# Altium project Cubesat EPS.PrjPcb (part 1 of 4)
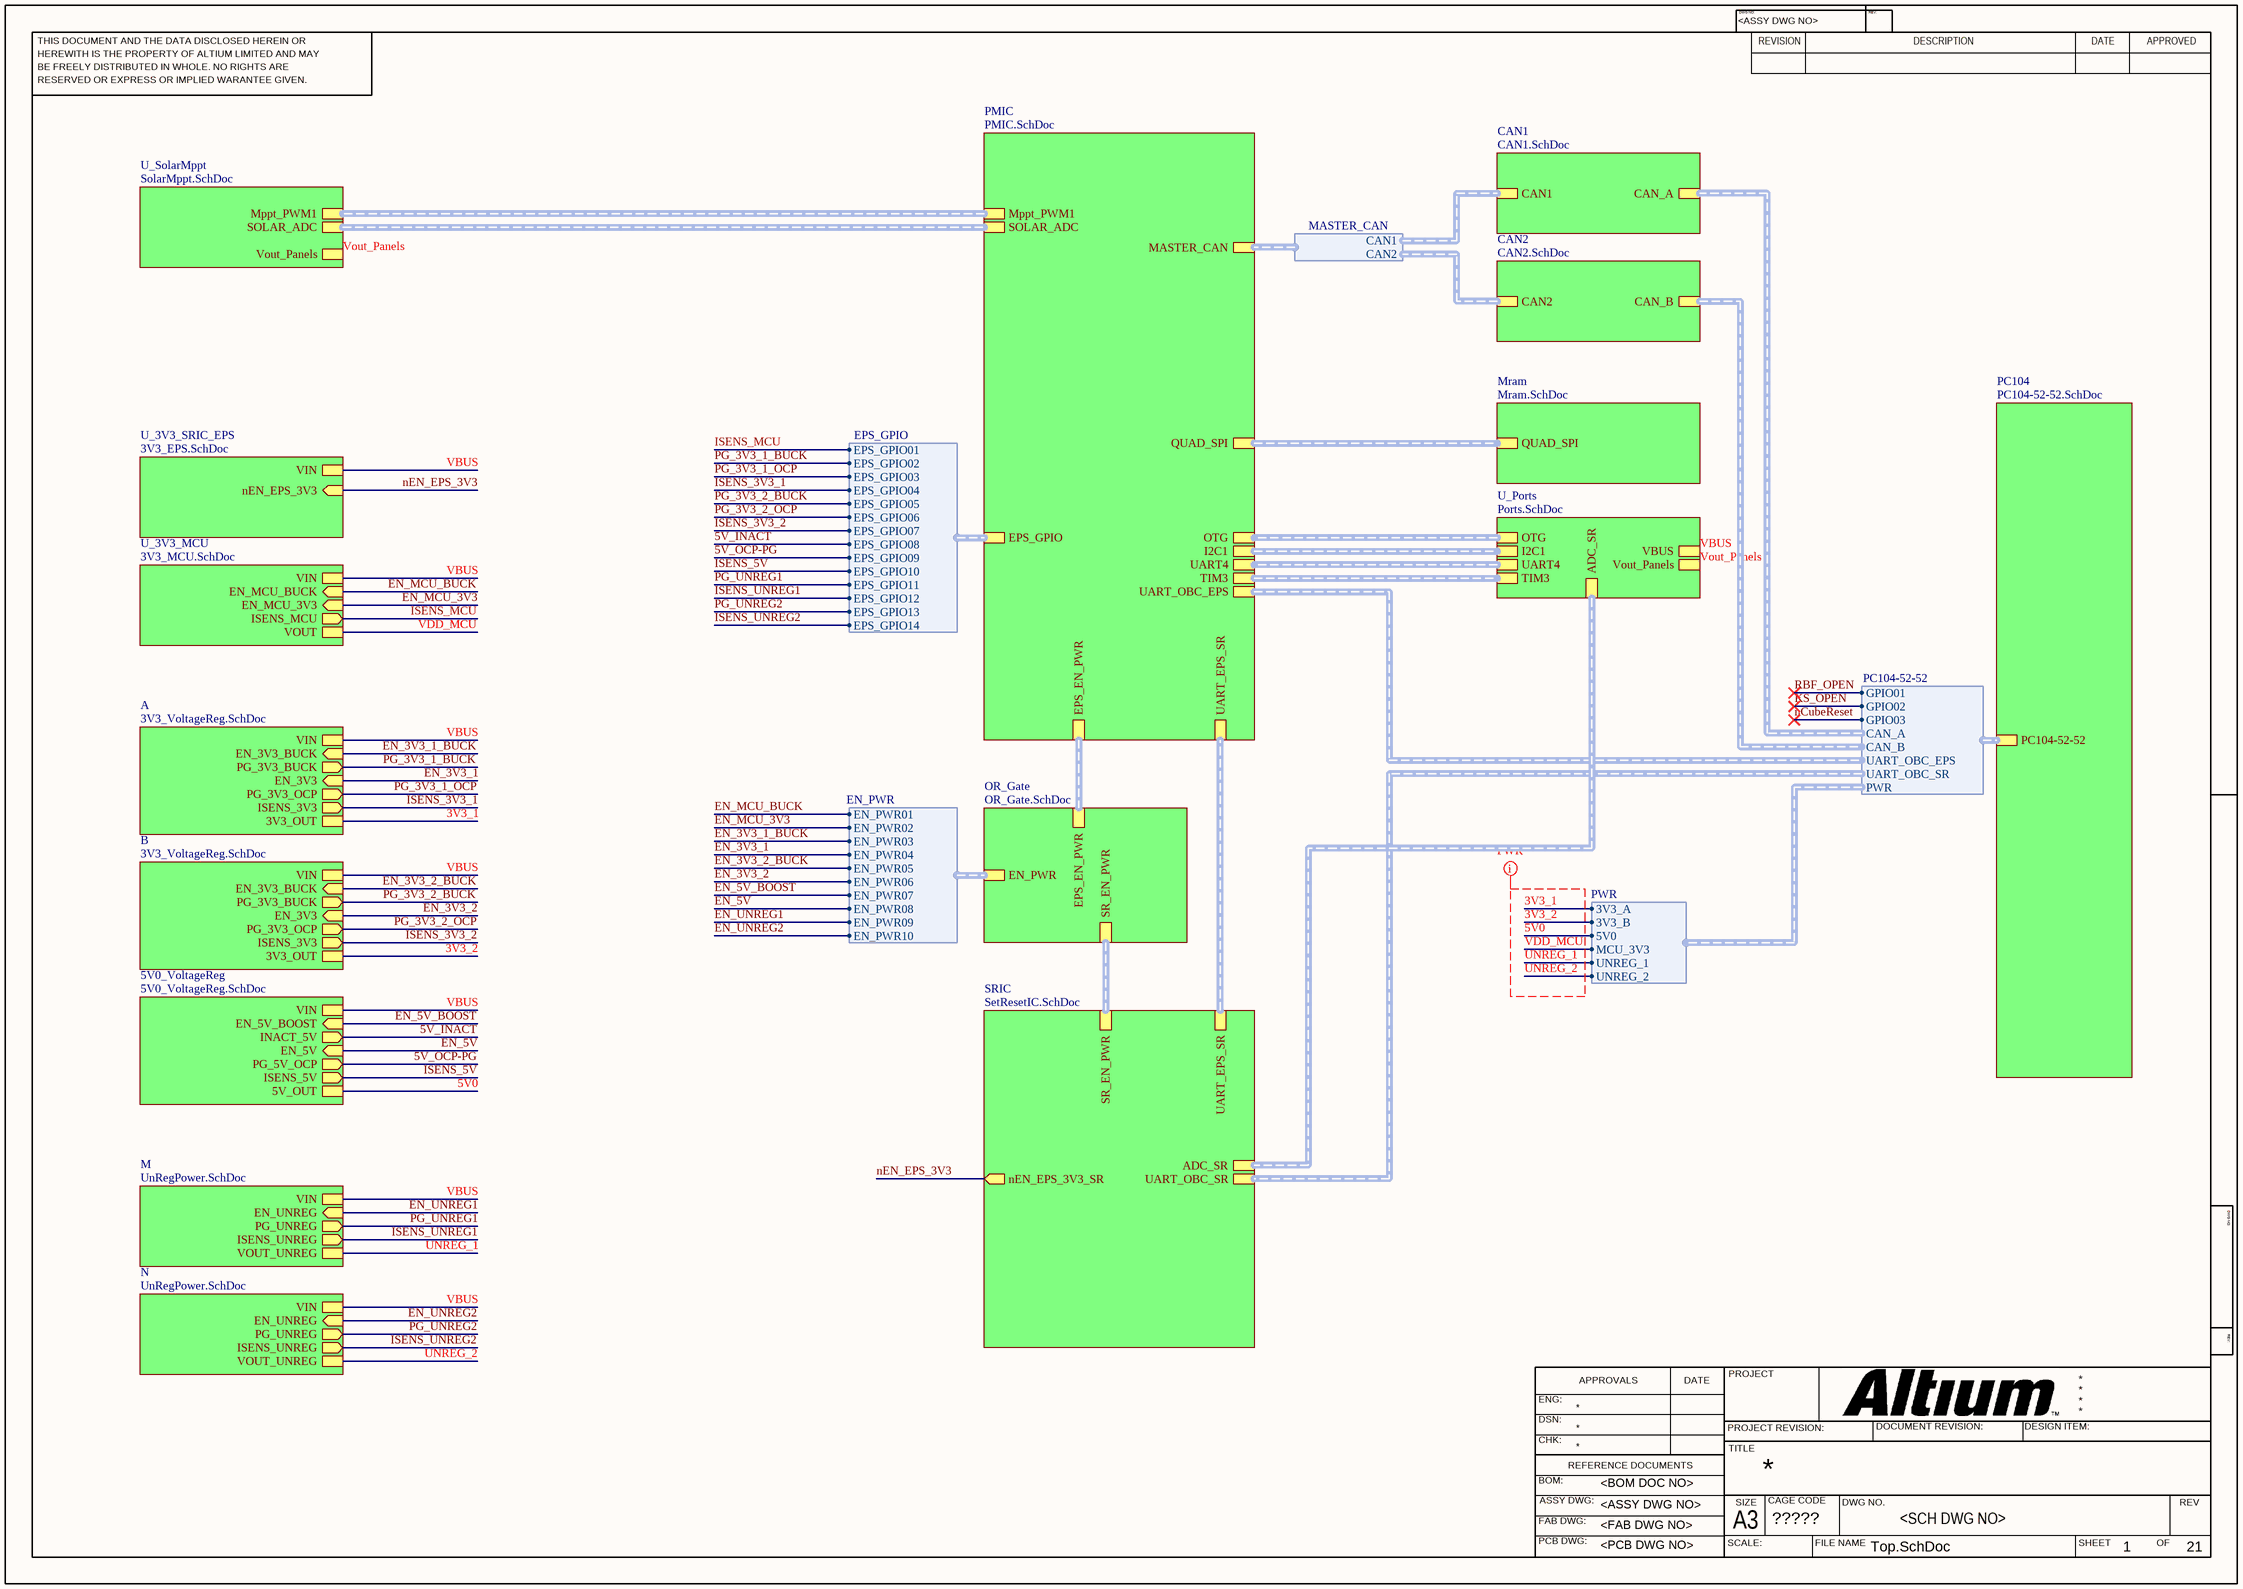
[diagram p0: Top.SchDoc]
CAGE_CODE: ?????; CONTRACT_NUMBER: <CONTRACT NO>; DOC_NO_ASSY_DWG: <ASSY DWG NO>; DOC_NO_BOM: <BOM DOC NO>; DOC_NO_FAB_DWG: <FAB DWG NO>; DOC_NO_SCH_DWG: <SCH DWG NO>; PCB_2_DEC_TOL: +/-.01; PCB_3_DEC_TOL: +/-.010; PCB_ANG_TOL: +/-1/2; PCB_ASSEMBLY_NO: <PCB ASSY NO>; PCB_CHECKER: - -----; PCB_CHECKER_APP_DATE: --/--/----; PCB_DESIGNER: - -----; PCB_DESIGNER_APP_DATE: --/--/----; PCB_DWG_NO: <PCB DWG NO>; PCB_ENGINEER: - -----; PCB_ENGINEER_APP_DATE: --/--/----; PCB_PART_NUMBER: <PCB PN>; PCB_REV: A; SCH_REV: A
21 sheets, 413 parts. Net scope: hierarchical (ports join the sheet entries above them; power ports are global).
Board file: EPS_v1.PcbDoc
Sheets:
  Top.SchDoc
    PMIC = PMIC.SchDoc
      PMIC_Watchdog = PMIC_Watchdog.SchDoc
      PMIC_Power = PMIC_Power.SchDoc
      PMIC_Crystal = PMIC_Crystal.SchDoc
      PMIC_Debug = PMIC_Debug.SchDoc
    PC104 = PC104-52-52.SchDoc
    Mram = Mram.SchDoc
    CAN1 = CAN1.SchDoc
    CAN2 = CAN2.SchDoc
    A = 3V3_VoltageReg.SchDoc
    5V0_VoltageReg = 5V0_VoltageReg.SchDoc
    U_3V3_MCU = 3V3_MCU.SchDoc
    U_3V3_SRIC_EPS = 3V3_EPS.SchDoc
    M = UnRegPower.SchDoc
    SRIC = SetResetIC.SchDoc
      U_SRIC_Peripherals = SRIC_Peripherals.SchDoc
    OR_Gate = OR_Gate.SchDoc
    U_Ports = Ports.SchDoc
    U_SolarMppt = SolarMppt.SchDoc
      XY = Panels.SchDoc
      ZX = Panels.SchDoc
      YZ = Panels.SchDoc
    B = 3V3_VoltageReg.SchDoc
    N = UnRegPower.SchDoc

## Sheet Top.SchDoc
size 420 x 297 mm; SheetNumber: 1; SheetTotal: 21

### Sub-sheets
5V0_VoltageReg = 5V0_VoltageReg.SchDoc: EN_5V (in), EN_5V_BOOST (in), PG_5V_OCP (out), INACT_5V (out), ISENS_5V (out), 5V_OUT, VIN
A = 3V3_VoltageReg.SchDoc: EN_3V3 (in), EN_3V3_BUCK (in), PG_3V3_BUCK (out), PG_3V3_OCP (out), ISENS_3V3 (out), 3V3_OUT, VIN
B = 3V3_VoltageReg.SchDoc: EN_3V3 (in), EN_3V3_BUCK (in), PG_3V3_BUCK (out), PG_3V3_OCP (out), ISENS_3V3 (out), 3V3_OUT, VIN
CAN1 = CAN1.SchDoc: CAN_A (harness CAN_A), CAN1 (harness CAN1)
CAN2 = CAN2.SchDoc: CAN_B (harness CAN_b), CAN2 (harness CAN2)
M = UnRegPower.SchDoc: EN_UNREG (in), PG_UNREG (out), ISENS_UNREG (out), VOUT_UNREG, VIN
Mram = Mram.SchDoc: QUAD_SPI (harness QUAD_SPI)
N = UnRegPower.SchDoc: EN_UNREG (in), PG_UNREG (out), ISENS_UNREG (out), VOUT_UNREG, VIN
OR_Gate = OR_Gate.SchDoc: EPS_EN_PWR (harness EPS_EN_PWR), SR_EN_PWR (harness SR_EN_PWR), EN_PWR (harness EN_PWR)
PC104 = PC104-52-52.SchDoc: PC104-52-52 (harness PC104-52-52)
PMIC = PMIC.SchDoc: MASTER_CAN (harness MASTER_CAN), QUAD_SPI (harness QUAD_SPI), EPS_EN_PWR (harness EPS_EN_PWR), EPS_GPIO (harness EPS_GPIO), UART4 (harness UART4), SOLAR_ADC (harness SOLAR_ADC), Mppt_PWM1 (harness Mppt_PWM), UART_EPS_SR (harness UART_EPS_SR), UART_OBC_EPS (harness UART_OBC_EPS), I2C1 (harness I2C1), OTG (harness OTG), TIM3 (harness TIM3)
SRIC = SetResetIC.SchDoc: UART_OBC_SR (harness UART_OBC_SR), SR_EN_PWR (harness SR_EN_PWR), UART_EPS_SR (harness UART_EPS_SR), nEN_EPS_3V3_SR (out), ADC_SR (harness ADC_SR)
U_3V3_MCU = 3V3_MCU.SchDoc: EN_MCU_3V3 (in), EN_MCU_BUCK (in), ISENS_MCU (out), VIN, VOUT
U_3V3_SRIC_EPS = 3V3_EPS.SchDoc: nEN_EPS_3V3 (in), VIN
U_Ports = Ports.SchDoc: UART4 (harness UART4), I2C1 (harness I2C1), OTG (harness OTG), TIM3 (harness TIM3), VBUS, Vout_Panels, ADC_SR (harness ADC_SR)
U_SolarMppt = SolarMppt.SchDoc: SOLAR_ADC (harness SOLAR_ADC), Mppt_PWM1 (harness Mppt_PWM), Vout_Panels

### Harnesses
MASTER_CAN: CAN1, CAN2
EN_PWR: EN_PWR01, EN_PWR02, EN_PWR03, EN_PWR04, EN_PWR05, EN_PWR06, EN_PWR07, EN_PWR08, EN_PWR09, EN_PWR10
EPS_GPIO: EPS_GPIO01, EPS_GPIO02, EPS_GPIO03, EPS_GPIO04, EPS_GPIO05, EPS_GPIO06, EPS_GPIO07, EPS_GPIO08, EPS_GPIO09, EPS_GPIO10, EPS_GPIO11, EPS_GPIO12, EPS_GPIO13, EPS_GPIO14
PWR: 3V3_A, 3V3_B, 5V0, MCU_3V3, UNREG_1, UNREG_2
PC104-52-52: GPIO01, GPIO02, GPIO03, CAN_A, CAN_B, PWR, UART_OBC_EPS, UART_OBC_SR

### Nets
3V3_1: sheet A/3V3_OUT, harness PWR.3V3_A
3V3_2: sheet B/3V3_OUT, harness PWR.3V3_B
5V0: sheet 5V0_VoltageReg/5V_OUT, harness PWR.5V0
5V_INACT: sheet 5V0_VoltageReg/INACT_5V, sheet PMIC/EPS_GPIO.EPS_GPIO08
5V_OCP-PG: sheet 5V0_VoltageReg/PG_5V_OCP, sheet PMIC/EPS_GPIO.EPS_GPIO09
EN_3V3_1: sheet A/EN_3V3, sheet OR_Gate/EN_PWR.EN_PWR04
EN_3V3_1_BUCK: sheet A/EN_3V3_BUCK, sheet OR_Gate/EN_PWR.EN_PWR03
EN_3V3_2: sheet B/EN_3V3, sheet OR_Gate/EN_PWR.EN_PWR06
EN_3V3_2_BUCK: sheet B/EN_3V3_BUCK, sheet OR_Gate/EN_PWR.EN_PWR05
EN_5V: sheet 5V0_VoltageReg/EN_5V, sheet OR_Gate/EN_PWR.EN_PWR08
EN_5V_BOOST: sheet 5V0_VoltageReg/EN_5V_BOOST, sheet OR_Gate/EN_PWR.EN_PWR07
EN_MCU_3V3: sheet U_3V3_MCU/EN_MCU_3V3, sheet OR_Gate/EN_PWR.EN_PWR02
EN_MCU_BUCK: sheet U_3V3_MCU/EN_MCU_BUCK, sheet OR_Gate/EN_PWR.EN_PWR01
EN_UNREG1: sheet M/EN_UNREG, sheet OR_Gate/EN_PWR.EN_PWR09
EN_UNREG2: sheet N/EN_UNREG, sheet OR_Gate/EN_PWR.EN_PWR10
ISENS_3V3_1: sheet A/ISENS_3V3, sheet PMIC/EPS_GPIO.EPS_GPIO04  [project net ADC1_IN5]
ISENS_3V3_2: sheet B/ISENS_3V3, sheet PMIC/EPS_GPIO.EPS_GPIO07  [project net ADC3_IN4]
ISENS_5V: sheet 5V0_VoltageReg/ISENS_5V, sheet PMIC/EPS_GPIO.EPS_GPIO10  [project net ADC3_IN3]
ISENS_MCU: sheet U_3V3_MCU/ISENS_MCU, sheet PMIC/EPS_GPIO.EPS_GPIO01  [project net ADC1_IN6]
ISENS_UNREG1: sheet M/ISENS_UNREG, sheet PMIC/EPS_GPIO.EPS_GPIO12  [project net ADC3_IN2]
ISENS_UNREG2: sheet N/ISENS_UNREG, sheet PMIC/EPS_GPIO.EPS_GPIO14  [project net ADC3_IN1]
nEN_EPS_3V3: sheet U_3V3_SRIC_EPS/nEN_EPS_3V3, sheet SRIC/nEN_EPS_3V3_SR
PG_3V3_1_BUCK: sheet A/PG_3V3_BUCK, sheet PMIC/EPS_GPIO.EPS_GPIO02
PG_3V3_1_OCP: sheet A/PG_3V3_OCP, sheet PMIC/EPS_GPIO.EPS_GPIO03
PG_3V3_2_BUCK: sheet B/PG_3V3_BUCK, sheet PMIC/EPS_GPIO.EPS_GPIO05
PG_3V3_2_OCP: sheet B/PG_3V3_OCP, sheet PMIC/EPS_GPIO.EPS_GPIO06
PG_UNREG1: sheet M/PG_UNREG, sheet PMIC/EPS_GPIO.EPS_GPIO11
PG_UNREG2: sheet N/PG_UNREG, sheet PMIC/EPS_GPIO.EPS_GPIO13
UNREG_1: sheet M/VOUT_UNREG, harness PWR.UNREG_1
UNREG_2: sheet N/VOUT_UNREG, harness PWR.UNREG_2
VBUS: sheet A/VIN, sheet 5V0_VoltageReg/VIN, sheet U_3V3_MCU/VIN, sheet U_3V3_SRIC_EPS/VIN, sheet M/VIN, sheet U_Ports/VBUS, sheet B/VIN, sheet N/VIN
VDD_MCU: sheet U_3V3_MCU/VOUT, harness PWR.MCU_3V3
Vout_Panels: sheet U_Ports/Vout_Panels, sheet U_SolarMppt/Vout_Panels

### Buses and harness runs
harness sheet Mram/QUAD_SPI = sheet PMIC/QUAD_SPI
harness sheet OR_Gate/EPS_EN_PWR = sheet PMIC/EPS_EN_PWR
harness sheet OR_Gate/SR_EN_PWR = sheet SRIC/SR_EN_PWR
harness sheet PMIC/I2C1 = sheet U_Ports/I2C1
harness sheet PMIC/Mppt_PWM1 = sheet U_SolarMppt/Mppt_PWM1
harness sheet PMIC/OTG = sheet U_Ports/OTG
harness sheet PMIC/SOLAR_ADC = sheet U_SolarMppt/SOLAR_ADC
harness sheet PMIC/TIM3 = sheet U_Ports/TIM3
harness sheet PMIC/UART4 = sheet U_Ports/UART4
harness sheet PMIC/UART_EPS_SR = sheet SRIC/UART_EPS_SR
harness sheet SRIC/ADC_SR = sheet U_Ports/ADC_SR

### Layout directives
net class PWR: 3V3_1, 3V3_2, 5V0, UNREG_1, UNREG_2, VDD_MCU

### Notes on the sheet
- THIS DOCUMENT AND THE DATA DISCLOSED HEREIN OR
- HEREWITH IS THE PROPERTY OF ALTIUM LIMITED AND MAY
- DWG NO:
- REVISION
- REV:
- DESCRIPTION
- DATE
- APPROVED
- BE FREELY DISTRIBUTED IN WHOLE. NO RIGHTS ARE
- RESERVED OR EXPRESS OR IMPLIED WARANTEE GIVEN.
- ENG:
- APPROVALS
- PROJECT
- DSN:
- CHK:
- REFERENCE DOCUMENTS
- PROJECT REVISION:
- TITLE
- DOCUMENT REVISION:
- DESIGN ITEM:
- BOM:
- FAB DWG:
- PCB DWG:
- ASSY DWG:
- SCALE:
- A3
- SIZE
- CAGE CODE
- FILE NAME
- DWG NO.
- SHEET
- OF
- REV

## Sheet PMIC.SchDoc
size 420 x 297 mm; SheetNumber: 11; SheetTotal: 21
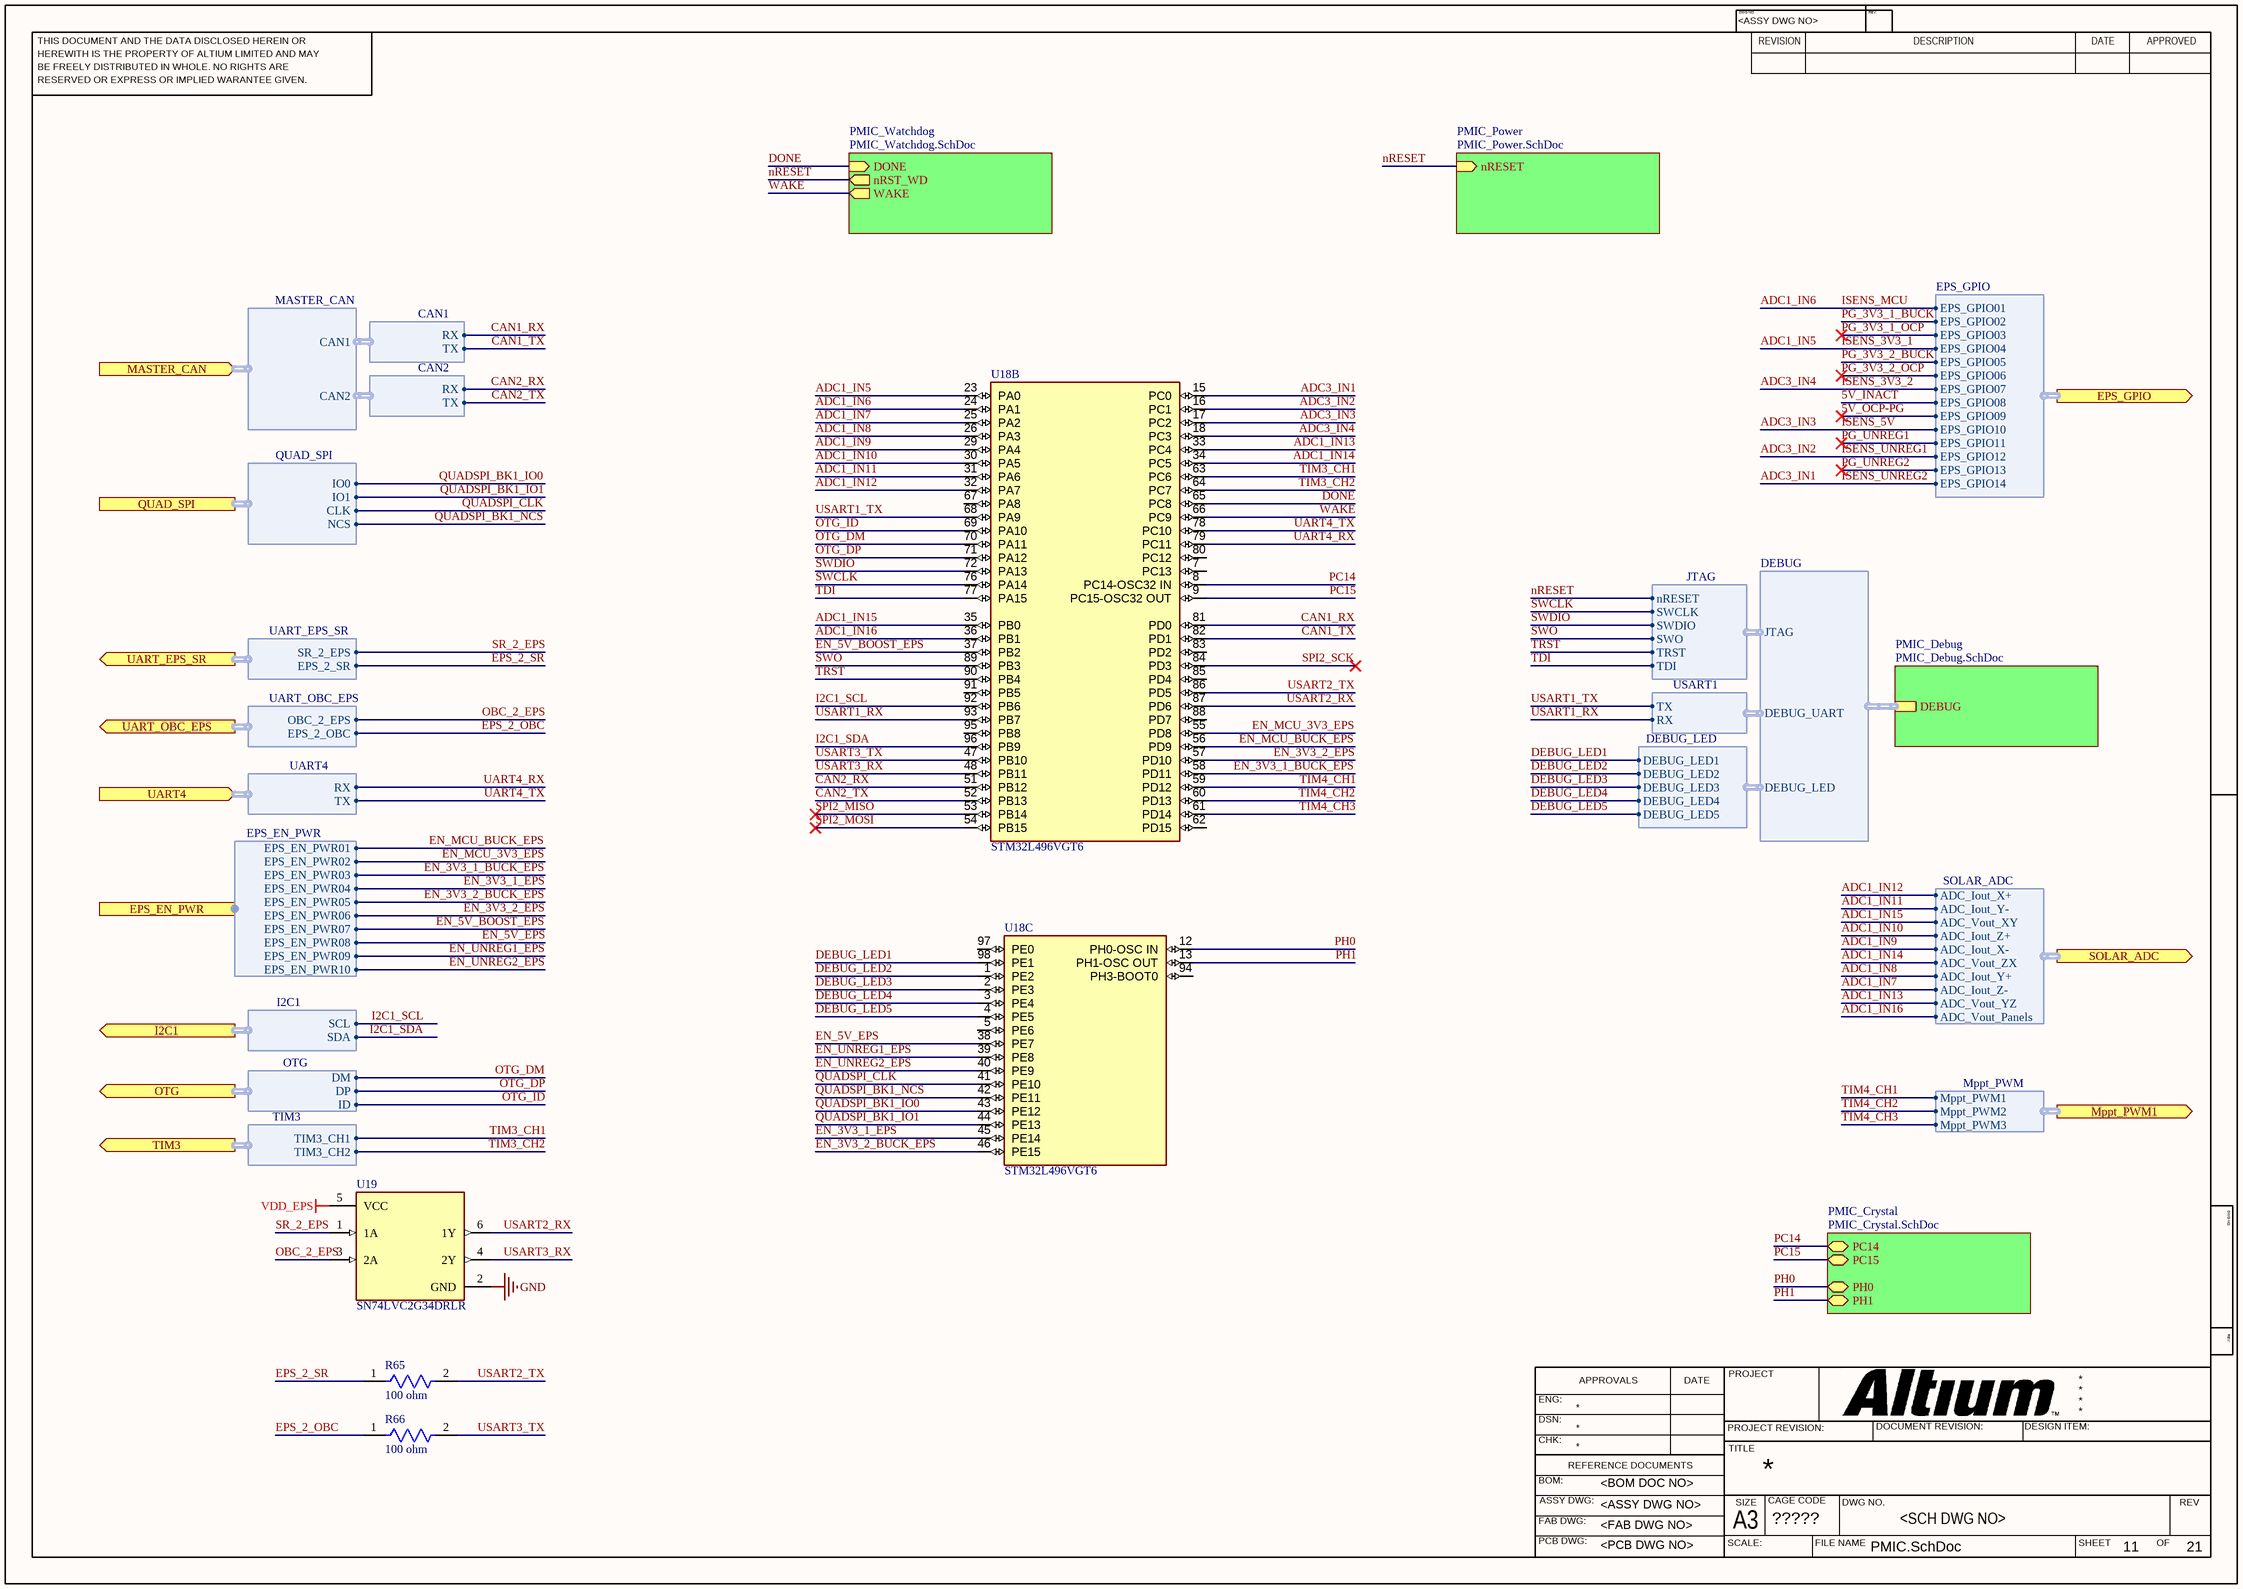
[diagram p1: PMIC.SchDoc]

### Parts
R65  100 ohm  [FP-ERJP03-MFG]
R66  100 ohm  [FP-ERJP03-MFG]
U18  STM32L496VGT6  [FP-LQFP100-1L-MFG]  (parts B,C of 3)
U19  SN74LVC2G34DRLR  [FP-DRL0006A-MFG]

### Sub-sheets
PMIC_Crystal = PMIC_Crystal.SchDoc: PC14 (bidir), PC15 (bidir), PH0 (bidir), PH1 (bidir)
PMIC_Debug = PMIC_Debug.SchDoc: DEBUG (harness DEBUG)
PMIC_Power = PMIC_Power.SchDoc: nRESET (in)
PMIC_Watchdog = PMIC_Watchdog.SchDoc: nRST_WD (out), DONE (in), WAKE (out)

### Ports
EPS_EN_PWR (out, harness EPS_EN_PWR), EPS_GPIO (out, harness EPS_GPIO), I2C1 (out, harness I2C1), MASTER_CAN (in, harness MASTER_CAN), Mppt_PWM1 (out, harness Mppt_PWM), OTG (out, harness OTG), QUAD_SPI (harness QUAD_SPI), SOLAR_ADC (out, harness SOLAR_ADC), TIM3 (out, harness TIM3), UART4 (in, harness UART4), UART_EPS_SR (out, harness UART_EPS_SR), UART_OBC_EPS (out, harness UART_OBC_EPS)

### Harnesses
MASTER_CAN: CAN1, CAN2
CAN1: TX, RX
CAN2: TX, RX
QUAD_SPI: IO0, IO1, CLK, NCS
EPS_GPIO: EPS_GPIO01, EPS_GPIO02, EPS_GPIO03, EPS_GPIO04, EPS_GPIO05, EPS_GPIO06, EPS_GPIO07, EPS_GPIO08, EPS_GPIO09, EPS_GPIO10, EPS_GPIO11, EPS_GPIO12, EPS_GPIO13, EPS_GPIO14
UART4: TX, RX
UART_EPS_SR: EPS_2_SR, SR_2_EPS
UART_OBC_EPS: EPS_2_OBC, OBC_2_EPS
EPS_EN_PWR: EPS_EN_PWR01, EPS_EN_PWR02, EPS_EN_PWR03, EPS_EN_PWR04, EPS_EN_PWR05, EPS_EN_PWR06, EPS_EN_PWR07, EPS_EN_PWR08, EPS_EN_PWR09, EPS_EN_PWR10
DEBUG: JTAG, DEBUG_UART, DEBUG_LED
JTAG: nRESET, SWCLK, SWDIO, SWO, TDI, TRST
USART1: TX, RX
DEBUG_LED: DEBUG_LED1, DEBUG_LED2, DEBUG_LED3, DEBUG_LED4, DEBUG_LED5
SOLAR_ADC: ADC_Iout_X+, ADC_Iout_Y-, ADC_Vout_XY, ADC_Iout_Z+, ADC_Iout_X-, ADC_Vout_ZX, ADC_Iout_Y+, ADC_Iout_Z-, ADC_Vout_YZ, ADC_Vout_Panels
Mppt_PWM: Mppt_PWM1, Mppt_PWM2, Mppt_PWM3
I2C1: SDA, SCL
OTG: DM, DP, ID
TIM3: TIM3_CH2, TIM3_CH1

### Nets
GND: U19.2(GND)
VDD_EPS: U19.5(VCC)
ADC1_IN5: U18.23(PA0) ; port EPS_GPIO.EPS_GPIO04  [also labelled ISENS_3V3_1]
ADC1_IN6: U18.24(PA1) ; port EPS_GPIO.EPS_GPIO01  [also labelled ISENS_MCU]
ADC1_IN7: U18.25(PA2) ; port SOLAR_ADC.ADC_Iout_Z-
ADC1_IN8: U18.26(PA3) ; port SOLAR_ADC.ADC_Iout_Y+
ADC1_IN9: U18.29(PA4) ; port SOLAR_ADC.ADC_Iout_X-
ADC1_IN10: U18.30(PA5) ; port SOLAR_ADC.ADC_Iout_Z+
ADC1_IN11: U18.31(PA6) ; port SOLAR_ADC.ADC_Iout_Y-
ADC1_IN12: U18.32(PA7) ; port SOLAR_ADC.ADC_Iout_X+
ADC1_IN13: U18.33(PC4) ; port SOLAR_ADC.ADC_Vout_YZ
ADC1_IN14: U18.34(PC5) ; port SOLAR_ADC.ADC_Vout_ZX
ADC1_IN15: U18.35(PB0) ; port SOLAR_ADC.ADC_Vout_XY
ADC1_IN16: U18.36(PB1) ; port SOLAR_ADC.ADC_Vout_Panels
ADC3_IN1: U18.15(PC0) ; port EPS_GPIO.EPS_GPIO14  [also labelled ISENS_UNREG2]
ADC3_IN2: U18.16(PC1) ; port EPS_GPIO.EPS_GPIO12  [also labelled ISENS_UNREG1]
ADC3_IN3: U18.17(PC2) ; port EPS_GPIO.EPS_GPIO10  [also labelled ISENS_5V]
ADC3_IN4: U18.18(PC3) ; port EPS_GPIO.EPS_GPIO07  [also labelled ISENS_3V3_2]
CAN1_RX: U18.81(PD0) ; harness CAN1.RX
CAN1_TX: U18.82(PD1) ; harness CAN1.TX
CAN2_RX: U18.51(PB12) ; harness CAN2.RX
CAN2_TX: U18.52(PB13) ; harness CAN2.TX
DEBUG_LED1: U18.98(PE1) ; harness DEBUG_LED.DEBUG_LED1
DEBUG_LED2: U18.1(PE2) ; harness DEBUG_LED.DEBUG_LED2
DEBUG_LED3: U18.2(PE3) ; harness DEBUG_LED.DEBUG_LED3
DEBUG_LED4: U18.3(PE4) ; harness DEBUG_LED.DEBUG_LED4
DEBUG_LED5: U18.4(PE5) ; harness DEBUG_LED.DEBUG_LED5
DONE: U18.65(PC8) ; sheet PMIC_Watchdog/DONE
EN_3V3_1_BUCK_EPS: U18.58(PD11) ; port EPS_EN_PWR.EPS_EN_PWR03
EN_3V3_1_EPS: U18.45(PE14) ; port EPS_EN_PWR.EPS_EN_PWR04
EN_3V3_2_BUCK_EPS: U18.46(PE15) ; port EPS_EN_PWR.EPS_EN_PWR05
EN_3V3_2_EPS: U18.57(PD10) ; port EPS_EN_PWR.EPS_EN_PWR06
EN_5V_BOOST_EPS: U18.37(PB2) ; port EPS_EN_PWR.EPS_EN_PWR07
EN_5V_EPS: U18.38(PE7) ; port EPS_EN_PWR.EPS_EN_PWR08
EN_MCU_3V3_EPS: U18.55(PD8) ; port EPS_EN_PWR.EPS_EN_PWR02
EN_MCU_BUCK_EPS: U18.56(PD9) ; port EPS_EN_PWR.EPS_EN_PWR01
EN_UNREG1_EPS: U18.39(PE8) ; port EPS_EN_PWR.EPS_EN_PWR09
EN_UNREG2_EPS: U18.40(PE9) ; port EPS_EN_PWR.EPS_EN_PWR10
EPS_2_OBC: R66.1 ; port UART_OBC_EPS.EPS_2_OBC
EPS_2_SR: R65.1 ; port UART_EPS_SR.EPS_2_SR
I2C1_SCL: U18.92(PB6) ; port I2C1.SCL
I2C1_SDA: U18.96(PB9) ; port I2C1.SDA
nRESET: sheet PMIC_Watchdog/nRST_WD, sheet PMIC_Power/nRESET, harness JTAG.nRESET
OBC_2_EPS: U19.3(2A) ; port UART_OBC_EPS.OBC_2_EPS
OTG_DM: U18.70(PA11) ; port OTG.DM
OTG_DP: U18.71(PA12) ; port OTG.DP
OTG_ID: U18.69(PA10) ; port OTG.ID
PC14: U18.8(PC14-OSC32_IN) ; sheet PMIC_Crystal/PC14
PC15: U18.9(PC15-OSC32_OUT) ; sheet PMIC_Crystal/PC15
PH0: U18.12(PH0-OSC_IN) ; sheet PMIC_Crystal/PH0
PH1: U18.13(PH1-OSC_OUT) ; sheet PMIC_Crystal/PH1
QUADSPI_BK1_IO0: U18.43(PE12) ; port QUAD_SPI.IO0
QUADSPI_BK1_IO1: U18.44(PE13) ; port QUAD_SPI.IO1
QUADSPI_BK1_NCS: U18.42(PE11) ; port QUAD_SPI.NCS
QUADSPI_CLK: U18.41(PE10) ; port QUAD_SPI.CLK
SPI2_MISO: U18.53(PB14)
SPI2_MOSI: U18.54(PB15)
SPI2_SCK: U18.84(PD3)
SR_2_EPS: U19.1(1A) ; port UART_EPS_SR.SR_2_EPS
SWCLK: U18.76(PA14) ; harness JTAG.SWCLK
SWDIO: U18.72(PA13) ; harness JTAG.SWDIO
SWO: U18.89(PB3) ; harness JTAG.SWO
TDI: U18.77(PA15) ; harness JTAG.TDI
TIM3_CH1: U18.63(PC6) ; port TIM3.TIM3_CH1
TIM3_CH2: U18.64(PC7) ; port TIM3.TIM3_CH2
TIM4_CH1: U18.59(PD12) ; port Mppt_PWM1.Mppt_PWM1  [project net Mppt_PWM1]
TIM4_CH2: U18.60(PD13) ; port Mppt_PWM1.Mppt_PWM2  [project net Mppt_PWM2]
TIM4_CH3: U18.61(PD14) ; port Mppt_PWM1.Mppt_PWM3  [project net Mppt_PWM3]
TRST: U18.90(PB4) ; harness JTAG.TRST
UART4_RX: U18.79(PC11) ; port UART4.RX
UART4_TX: U18.78(PC10) ; port UART4.TX
USART1_RX: U18.93(PB7) ; harness USART1.RX  [project net DEBUG_UART_RX]
USART1_TX: U18.68(PA9) ; harness USART1.TX  [project net DEBUG_UART_TX]
USART2_RX: U18.87(PD6) U19.6(1Y)
USART2_TX: R65.2 U18.86(PD5)
USART3_RX: U18.48(PB11) U19.4(2Y)
USART3_TX: R66.2 U18.47(PB10)
WAKE: U18.66(PC9) ; sheet PMIC_Watchdog/WAKE

Not connected (* = marked no-connect by the designer): U18 5(PE6) 7(PC13) 62(PD15) 67(PA8) 80(PC12) 83(PD2) 85(PD4) 88(PD7) 91(PB5) 94(PH3-BOOT0) 95(PB8) 97(PE0)

### Notes on the sheet
- THIS DOCUMENT AND THE DATA DISCLOSED HEREIN OR
- HEREWITH IS THE PROPERTY OF ALTIUM LIMITED AND MAY
- DWG NO:
- REVISION
- REV:
- DESCRIPTION
- DATE
- APPROVED
- BE FREELY DISTRIBUTED IN WHOLE. NO RIGHTS ARE
- RESERVED OR EXPRESS OR IMPLIED WARANTEE GIVEN.
- ENG:
- APPROVALS
- PROJECT
- DSN:
- CHK:
- REFERENCE DOCUMENTS
- PROJECT REVISION:
- TITLE
- DOCUMENT REVISION:
- DESIGN ITEM:
- BOM:
- FAB DWG:
- PCB DWG:
- ASSY DWG:
- SCALE:
- A3
- SIZE
- CAGE CODE
- FILE NAME
- DWG NO.
- SHEET
- OF
- REV

### Library data of the parts
R65 R66 = CMP-00287-21317759-1: ERJ-P03F1000V SMD Chip Resistor, 100 Ohm, ± 1%, 200 mW, 0603 [1608 Metric], Thick Film, Anti-Surge; Temperature Coefficient: 200ppm/°C; Resistance: 100Ω; Voltage Rating (DC): 150V; Power Rating: 200mW; Tolerance: 1%; Termination: Tab; RoHS: Compliant; Composition: Thick Film; Min Operating Temperature: -55°C; Contact Plating: Tin; Case Code (Metric): 1608; Case/Package: 0603; Radiation Hardening: No; Mount: Surface Mount; Voltage Rating: 150V; Packaging: Cut Tape; Length: 1.6mm; REACH SVHC: No SVHC; Max Operating Temperature: 155°C; Depth: 800µm; Number of Pins: 2; Lifecycle Status: Production; Schedule B: 8533210045, 8533210045; Military Standard: Not; Height: 550µm; NexarPartId: 21317759; Case Code (Imperial): 0603
U18 = CMP-12105-000032-1: IC MCU 32BIT 1MB FLASH 100LQFP; Manufacturer: STMicroelectronics; Ram Size: 320KBytes; Number Of Usb Channels: 1; Interface: I2C,SPI,UART,USART,CAN,USB,LIN,IrDA,Other; Frequency: 80MHz; Min Supply Voltage: 1.05V; Number Of I/Os: 83; Number Of Adc Channels: 16; Number Of Spi Channels: 3; Core Architecture: ARM Cortex-M4; Number Of I2C Channels: 4; Number Of Uart Channels: 6; Max Junction Temp: +105°C; Number Of Pwm Channels: 2; Data Bus Width: 32bits; Standoff Height: 0.05mm; Memory Type: FLASH,SRAM; Max Supply Voltage: 3.6V; Memory Size: 1MBytes; Temperature Range High: +85°C; Device Class L2: Embedded Processors and Controllers; Number Of Cores: 1; Temperature Range Low: -40°C; ComponentLink2URL: https://www.st.com/content/ccc/resource/technical/document/datasheet/group3/3f/73/19/d1/d4/9e/48/34/DM00284211/files/DM00284211.pdf/jcr:content/translations/en.DM00284211.pdf; Temperature: -40°C to +85°C; Device Class L3: Microcontrollers; Device Class L1: Integrated Circuits (ICs); Height: 1.6mm; Manufacturer Part Number: STM32L496VGT6; Ambient Temperature Range Low: -40°C; RoHS: TRUE; Automotive: No; Number Of A/D Converters: 3; Ambient Temperature Range High: +85°C; Digikey Description: IC MCU 32BIT 1MB FLASH 100LQFP; ComponentLink2Description: Datasheet; Package: LQFP100-1L; Lead Free: Yes; Octopart: https://octopart.com/stm32l496vgt6-stmicroelectronics-80826723; Category: IC; Number Of Timers/Counters: 16
U19 = CMP-0859-00812-4: IC BUFFER NON-INVERT 5.5V 6SOT; Number of Bits per Element: 1; Number of Bits: 2; Low Level Output Current: 32mA; Polarity: Non-Inverting; Min Supply Voltage: 1.65V; Propagation Delay: 8.6ns; High Level Output Current: -32mA; Quiescent Current: 10uA; Contact Plating: Gold; Case/Package: SOT; Technology: CMOS; Min Operating Temperature: -40°C; Number of Elements: 2; REACH SVHC: No SVHC; Number of Channels: 2; Series: 74LVC; Number of Pins: 6; Mount: Surface Mount; Logic Function: Buffer; Number of Output Lines: 2; Packaging: Tape and Reel; Package Quantity: 4000; Radiation Hardening: No; Number of Gates: 2; Turn-On Delay Time: 8.6ns; Max Operating Temperature: 125°C; Max Supply Voltage: 5.5V; Lead Free: Lead Free; RoHS Compliant: Yes; Number of Outputs: 2; Number of Inputs: 2; Number of Input Lines: 2

## Sheet PMIC_Watchdog.SchDoc
size 420 x 297 mm; SheetNumber: 13; SheetTotal: 21
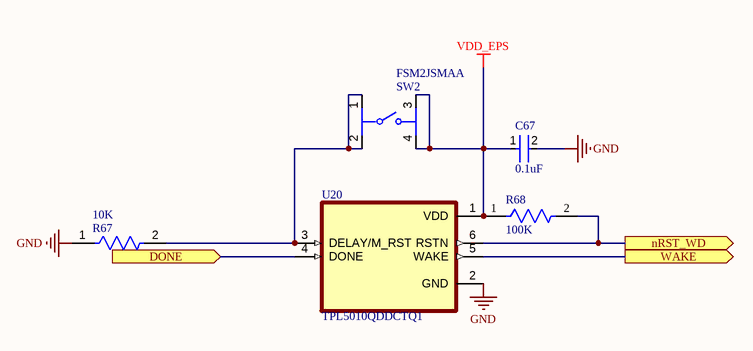
[diagram p2: PMIC_Watchdog.SchDoc]

### Parts
C67  0.1uF  [FP-C0603C-CF-MFG]
R67  10K  [FP-RK73B1J-MFG]
R68  100K  [FP-ERA3A-MFG]
SW2  FSM2JSMAA  [FP-FSM2JSMAA-MFG]
U20  TPL5010QDDCTQ1  [SOT95P280X110-6N]

### Ports
DONE (in), nRST_WD (out), WAKE (out)

### Nets
GND: C67.2 R67.1 U20.2(GND)
VDD_EPS: C67.1 R68.1 SW2.3 SW2.4 U20.1(VDD)
DONE: U20.4(DONE) ; port DONE
nRESET: R68.2 U20.6(RSTN) ; port nRST_WD
WAKE: U20.5(WAKE) ; port WAKE
NetR67_2: R67.2 SW2.1 SW2.2 U20.3(DELAY/M_RST)

### Notes on the sheet
- THIS DOCUMENT AND THE DATA DISCLOSED HEREIN OR
- HEREWITH IS THE PROPERTY OF ALTIUM LIMITED AND MAY
- DWG NO:
- REVISION
- REV:
- DESCRIPTION
- DATE
- APPROVED
- BE FREELY DISTRIBUTED IN WHOLE. NO RIGHTS ARE
- RESERVED OR EXPRESS OR IMPLIED WARANTEE GIVEN.
- ENG:
- APPROVALS
- PROJECT
- DSN:
- CHK:
- REFERENCE DOCUMENTS
- PROJECT REVISION:
- TITLE
- DOCUMENT REVISION:
- DESIGN ITEM:
- BOM:
- FAB DWG:
- PCB DWG:
- ASSY DWG:
- SCALE:
- A3
- SIZE
- CAGE CODE
- FILE NAME
- DWG NO.
- SHEET
- OF
- REV

### Library data of the parts
C67 = CMP-2006-03061-2: CAP CER 0.1UF 50V X7R 0603; Manufacturer: KEMET; Manufacturer Part Number: C0603C104K5RACTU; Tolerance: 0.1; Temperature Coefficient: 30ppm/°C; Material: Ceramic; Automotive Grade: Grade 1; Value: 0.10 μF; Temperature: -55°C to +125°C; RoHS: TRUE; Temperature Range High: +125°C; Lead Free: Yes; Octopart: https://octopart.com/c0603c104k5ractu-kemet-139244; Digikey Description: CAP CER 0.1UF 50V X7R 0603; Category: Cap; Package: C0603C-CF; ComponentLink2Description: Datasheet; Temperature Range Low: -55°C; Device Class L1: Passive Components; Voltage Rating: 50 V; Automotive: Yes; Device Class L3: Ceramic Capacitors; ComponentLink2URL: https://api.kemet.com/component-edge/download/datasheet/C0603C100J5GACAUTO.pdf; Capacitance: 0.10 μF; Device Class L2: Capacitors; Temperature Characteristic: X7R; Height: 0.87mm
R67 = CMP-2000-01851-2: RES 10K OHM 5% 1/10W 0603; Temperature Coefficient: 200ppm/°C; Voltage Rating: 50V; Power Rating: 100mW; Resistance: 10kR; Length: 1.6mm; Lead Free: Lead Free; Resistance Tolerance: 5%; Case Code (Metric): 1608; Width: 0.8mm; Height: 0.45mm; Max Operating Temperature: 155°C; RoHS Compliant: Yes; Resistor Type: Thick Film; Min Operating Temperature: -55°C; Case Code (Imperial): 0603; Technology: THICK FILM; Package Quantity: 5000; Tolerance: 5%; Case/Package: 0603; Voltage Rating (DC): 50V; Depth: 0.8mm; Packaging: Tape and Reel; Number of Pins: 2; Construction: Rectangular; Series: RK73B; Military Standard: Not; Termination: SMD/SMT
R68 = CMP-2000-00875-2: NexarPartId: 1243428; Power Rating: 100mW; Voltage Rating (DC): 75V; Tolerance: 0.1%; Temperature Coefficient: 25ppm/°C; Resistance: 100kΩ; Contact Plating: Tin; Max Operating Temperature: 155°C; Case Code (Imperial): 0603; Packaging: Cut Tape; Width: 800µm; Lead Free: Lead Free; REACH SVHC: No SVHC; Termination: SMD/SMT; Radiation Hardening: No; Length: 1.6mm; Military Standard: Not; Features: Automotive AEC-Q200; Case/Package: 0603; Number of Terminations: 2; Composition: Thin Film; Schedule B: 8533210045, 8533210045; Voltage Rating: 75V; Mount: Surface Mount; Case Code (Metric): 1608; Lifecycle Status: Production; Height: 450µm; RoHS: Compliant; Number of Pins: 2; Max Power Dissipation: 100mW; Min Operating Temperature: -55°C; Depth: 800µm; Working Voltage: 75V
SW2 = CMP-03402-000003-1: SWITCH TACTILE SPST-NO 0.05A 24V; Manufacturer: TE Connectivity; Standoff Height: 0.05mm; Contact Current Rating: 50mA; Electromechanical Life: 100000Cycles; Operating Force: 260gf; Contact Resistance: 100mΩ; Package: 0; Temperature Range High: +85°C; Temperature: -35°C to +85°C; Category: Switch; Manufacturer Part Number: FSM2JSMAA; RoHS: TRUE; Mouser Description: Tactile Switches TACTILE 260G FORCE S; Device Class L1: Electromechanical; Mount: Surface Mount; Height: 4.59mm; ComponentLink2URL: https://www.te.com/commerce/DocumentDelivery/DDEController?Action=showdoc&DocId=Customer+Drawing%7F2-1437565-7%7FV%7Fpdf%7FEnglish%7FENG_CD_2-1437565-7_V.pdf%7F2-1437565-8; Temperature Range Low: -35°C; Voltage Rating Dc: 24V; Lead Free: Yes; Automotive: No; Throw Configuration: SPST-NO; Octopart: https://octopart.com/fsm2jsmaa-te+connectivity-41720620; Device Class L2: Switches; Device Class L3: Pushbutton Switches; ComponentLink2Description: Datasheet; Digikey Description: SWITCH TACTILE SPST-NO 0.05A 24V
U20 = CMP-049-000000-1: Automotive AEC-Q100, nano-powered system timer with watchdog function; MF: Texas Instruments; MP: TPL5010QDDCTQ1; Check_prices: https://www.snapeda.com/parts/TPL5010QDDCTQ1/Texas+Instruments/view-part/?ref=eda; Source: TPL5010QDDCTQ1.SchLib; Package: SOT-23-THN-6 Texas Instruments; SnapEDA_Link: https://www.snapeda.com/parts/TPL5010QDDCTQ1/Texas+Instruments/view-part/?ref=snap; Component Type: Standard; Value: *; Pin Count: 6; Design Item ID: TPL5010QDDCTQ1

## Sheet PMIC_Power.SchDoc
size 420 x 297 mm; SheetNumber: 12; SheetTotal: 21
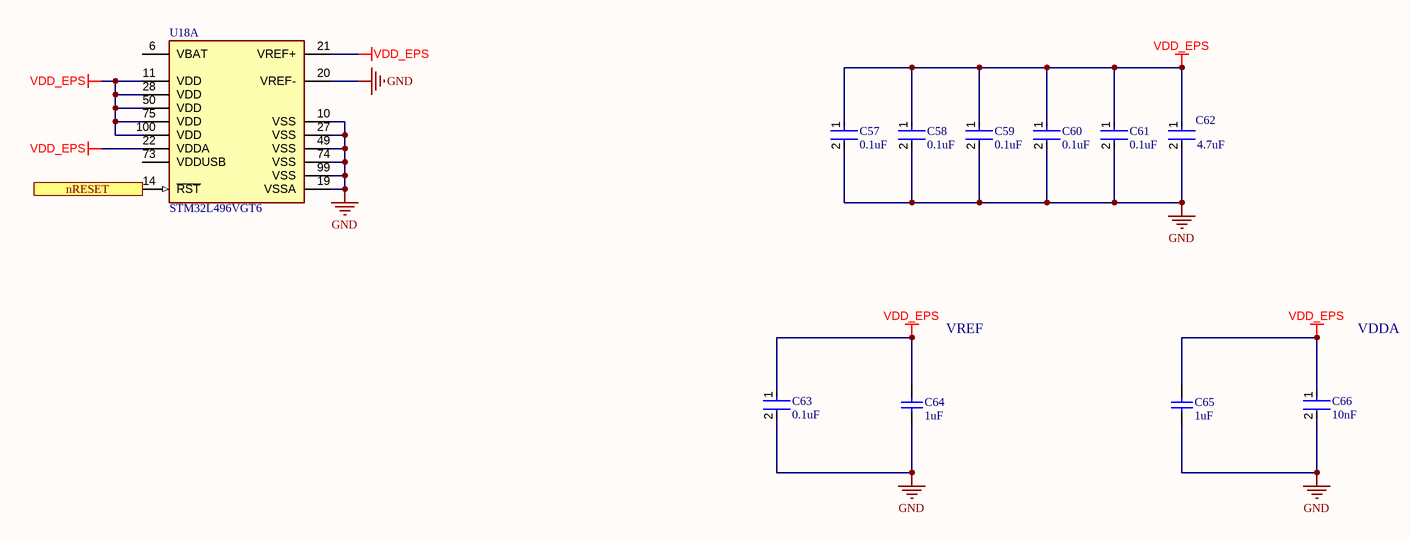
[diagram p3: PMIC_Power.SchDoc]

### Parts
C57  0.1uF  [FP-C0603C-CF-MFG]
C58  0.1uF  [FP-C0603C-CF-MFG]
C59  0.1uF  [FP-C0603C-CF-MFG]
C60  0.1uF  [FP-C0603C-CF-MFG]
C61  0.1uF  [FP-C0603C-CF-MFG]
C62  4.7uF  [FP-GRM188-0_15-IPC_A]
C63  0.1uF  [FP-C0603C-CF-MFG]
C64  1uF  [CAPC1608X90X35LL15T15]
C65  1uF  [CAPC1608X90X35LL15T15]
C66  10nF  [FP-GRM188-0_1-e0_2_0_5-IPC_A]
U18  STM32L496VGT6  [FP-LQFP100-1L-MFG]  (part A of 3)

### Ports
nRESET (in)

### Nets
GND: C57.2 C58.2 C59.2 C60.2 C61.2 C62.2 C63.2 C64.2 C65.2 C66.2 U18.10(VSS) U18.19(VSSA) U18.20(VREF-) U18.27(VSS) U18.49(VSS) U18.74(VSS) U18.99(VSS)
VDD_EPS: C57.1 C58.1 C59.1 C60.1 C61.1 C62.1 C63.1 C64.1 C65.1 C66.1 U18.11(VDD) U18.21(VREF+) U18.22(VDDA) U18.28(VDD) U18.50(VDD) U18.75(VDD) U18.100(VDD)
nRESET: U18.14(~{RST}) ; port nRESET

Not connected (* = marked no-connect by the designer): U18 6(VBAT) 73(VDDUSB)

### Notes on the sheet
- VREF
- VDDA
- THIS DOCUMENT AND THE DATA DISCLOSED HEREIN OR
- HEREWITH IS THE PROPERTY OF ALTIUM LIMITED AND MAY
- DWG NO:
- REVISION
- REV:
- DESCRIPTION
- DATE
- APPROVED
- BE FREELY DISTRIBUTED IN WHOLE. NO RIGHTS ARE
- RESERVED OR EXPRESS OR IMPLIED WARANTEE GIVEN.
- ENG:
- APPROVALS
- PROJECT
- DSN:
- CHK:
- REFERENCE DOCUMENTS
- PROJECT REVISION:
- TITLE
- DOCUMENT REVISION:
- DESIGN ITEM:
- BOM:
- FAB DWG:
- PCB DWG:
- ASSY DWG:
- SCALE:
- A3
- SIZE
- CAGE CODE
- FILE NAME
- DWG NO.
- SHEET
- OF
- REV

### Library data of the parts
C57-C61 C63 = CMP-2006-03061-2: as C67 on sheet PMIC_Watchdog; Temperature: -55°C to +125°C; RoHS: TRUE; Temperature Range High: +125°C; Lead Free: Yes; Octopart: https://octopart.com/c0603c104k5ractu-kemet-139244; Digikey Description: CAP CER 0.1UF 50V X7R 0603; Category: Cap; Package: C0603C-CF; ComponentLink2Description: Datasheet; Temperature Range Low: -55°C; Device Class L1: Passive Components; Voltage Rating: 50 V; Automotive: Yes; Device Class L3: Ceramic Capacitors; ComponentLink2URL: https://api.kemet.com/component-edge/download/datasheet/C0603C100J5GACAUTO.pdf; Capacitance: 0.10 μF; Device Class L2: Capacitors; Temperature Characteristic: X7R; Height: 0.87mm
C62 = CMP-06035-000034-2: CAP CER 4.7UF 10V X7S 0603; Material: Ceramic; Tolerance: 10%; Height: 0.8mm; Termination: SMD/SMT; Case Code (Metric): 1608; Voltage Rating: 10V; Width: 0.8mm; Resistor Type: Ceramic; Length: 1.6mm; Voltage Rating (DC): 10V; Weight: 0.000222oz; Dielectric: X7S; Package Quantity: 4000; Mount: Surface Mount; Case Code (Imperial): 0603; Case/Package: 0603; Packaging: Tape and Reel; Thickness: 0.037inch; Min Operating Temperature: -55°C; Capacitance: 4.7uF; Max Operating Temperature: 125°C
C64 C65 = CMP-2006-02298-2: Manufacturer: Kemet; Part Number: C0603C105K4RACTU
C66 = CMP-2006-02943-2: Chip Multilayer Ceramic Capacitors for General Purpose, 0603, 10000pF, X7R, 15%, 10%, 100V; Capacitance: 10nF; Dielectric: X7R; Material: Ceramic; Package Quantity: 4000; Voltage: 100V; Mount: Surface Mount; Min Operating Temperature: -55°C; Thickness: 0.035inch; Height: 0.8mm; Max Operating Temperature: 125°C; Radiation Hardening: No; Lead Free: Lead Free; Case Code (Metric): 1608; REACH SVHC: No SVHC; Termination: SMD/SMT; Tolerance: 10%; Voltage Rating: 100V; Voltage Rating (DC): 100V; Length: 1.6mm; Depth: 0.8mm; Width: 0.031inch; Case Code (Imperial): 0603; Case/Package: 0603; Packaging: Tape and Reel
U18 = CMP-12105-000032-1: as U18 on sheet PMIC; Temperature Range High: +85°C; Device Class L2: Embedded Processors and Controllers; Number Of Cores: 1; Temperature Range Low: -40°C; ComponentLink2URL: https://www.st.com/content/ccc/resource/technical/document/datasheet/group3/3f/73/19/d1/d4/9e/48/34/DM00284211/files/DM00284211.pdf/jcr:content/translations/en.DM00284211.pdf; Temperature: -40°C to +85°C; Device Class L3: Microcontrollers; Device Class L1: Integrated Circuits (ICs); Height: 1.6mm; Manufacturer Part Number: STM32L496VGT6; Ambient Temperature Range Low: -40°C; RoHS: TRUE; Automotive: No; Number Of A/D Converters: 3; Ambient Temperature Range High: +85°C; Digikey Description: IC MCU 32BIT 1MB FLASH 100LQFP; ComponentLink2Description: Datasheet; Package: LQFP100-1L; Lead Free: Yes; Octopart: https://octopart.com/stm32l496vgt6-stmicroelectronics-80826723; Category: IC; Number Of Timers/Counters: 16

## Sheet PMIC_Crystal.SchDoc
size 420 x 297 mm; SheetNumber: 14; SheetTotal: 21
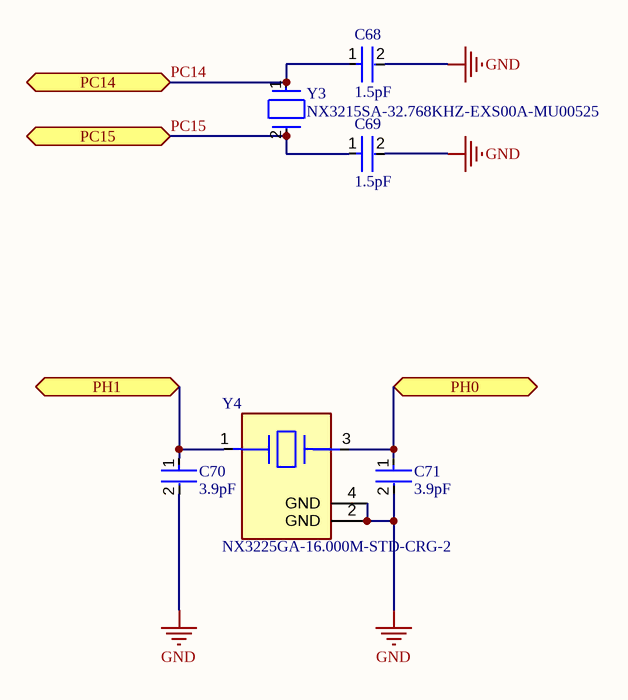
[diagram p4: PMIC_Crystal.SchDoc]

### Parts
C68  1.5pF  [FP-C0603C-CF-MFG]
C69  1.5pF  [FP-C0603C-CF-MFG]
C70  3.9pF  [FP-CBR06C-MFG]
C71  3.9pF  [FP-CBR06C-MFG]
Y3  NX3215SA-32.768KHZ-EXS00A-MU00525  [FP-NX3215SA-MFG]
Y4  NX3225GA-16.000M-STD-CRG-2  [FP-NX3225GA-MFG]

### Ports
PC14 (bidir), PC15 (bidir), PH0 (bidir), PH1 (bidir)

### Nets
GND: C68.2 C69.2 C70.2 C71.2 Y4.2(GND) Y4.4(GND)
PC14: C68.1 Y3.1 ; port PC14
PC15: C69.1 Y3.2 ; port PC15
PH0: C71.1 Y4.3 ; port PH0
PH1: C70.1 Y4.1 ; port PH1

### Notes on the sheet
- THIS DOCUMENT AND THE DATA DISCLOSED HEREIN OR
- HEREWITH IS THE PROPERTY OF ALTIUM LIMITED AND MAY
- DWG NO:
- REVISION
- REV:
- DESCRIPTION
- DATE
- APPROVED
- BE FREELY DISTRIBUTED IN WHOLE. NO RIGHTS ARE
- RESERVED OR EXPRESS OR IMPLIED WARANTEE GIVEN.
- ENG:
- APPROVALS
- PROJECT
- DSN:
- CHK:
- REFERENCE DOCUMENTS
- PROJECT REVISION:
- TITLE
- DOCUMENT REVISION:
- DESIGN ITEM:
- BOM:
- FAB DWG:
- PCB DWG:
- ASSY DWG:
- SCALE:
- A3
- SIZE
- CAGE CODE
- FILE NAME
- DWG NO.
- SHEET
- OF
- REV

### Library data of the parts
C68 C69 = CMP-2006-03373-2: CAP CER 1.5PF 100V NP0 0603; Manufacturer Part Number: C0603C159C1GACTU; Manufacturer: KEMET; Material: Ceramic; Temperature Coefficient: 30ppm/°C; Temperature Characteristic: C0G; Tolerance: 0.25 pF; Automotive Grade: Grade 1; Mouser Description: Multilayer Ceramic Capacitors MLCC - SMD/SMT 100volts 1.5pF C0G 0.25%; Lead Free: Yes; Value: 1.5 pF; Temperature Range Low: -55°C; Temperature: -55°C to +125°C; Device Class L1: Passive Components; Device Class L3: Ceramic Capacitors; Package: C0603C-CF; Category: Cap; ComponentLink2Description: Datasheet; Voltage Rating: 100 V; Device Class L2: Capacitors; Height: 0.87mm; Temperature Range High: +125°C; RoHS: TRUE; Octopart: https://octopart.com/c0603c159c1gactu-kemet-9144220; Digikey Description: CAP CER 1.5PF 100V NP0 0603; Automotive: Yes; ComponentLink2URL: https://api.kemet.com/component-edge/download/datasheet/C0603C100J5GACAUTO.pdf; Capacitance: 1.5 pF
C70 C71 = CMP-2006-02987-2: CAP CER 3.9PF 250V C0G/NP0 0603; Manufacturer Part Number: CBR06C399CAGAC; Manufacturer: KEMET; Material: Ceramic; Tolerance: 0.25 pF; Temperature Characteristic: C0G; Temperature Coefficient: 30ppm/°C; Octopart: https://octopart.com/cbr06c399cagac-kemet-20446767; Height: 0.87mm; Category: Cap; Temperature: -55°C to +125°C; Device Class L1: Passive Components; Capacitance: 3.9 pF; Device Class L3: Ceramic Capacitors; Value: 3.9 pF; Voltage Rating: 250 V; Mouser Description: Multilayer Ceramic Capacitors MLCC - SMD/SMT 250volts 3.9pF C0G 0603 .25pF Tol RF; Temperature Range High: +125°C; Ipc Land Pattern Name: CAPC16080X80; ComponentLink2Description: Datasheet; Temperature Range Low: -55°C; Digikey Description: CAP CER 3.9PF 250V C0G/NP0 0603; ComponentLink2URL: https://content.kemet.com/datasheets/KEM_C1030_CBR_SMD.pdf; Lead Free: Yes; Package: CBR06C; Device Class L2: Capacitors; RoHS: TRUE; Automotive: No
Y3 = CMP-200220-000018-1: CRYSTAL 32.7680KHZ 6PF SMD; ESR (Equivalent Series Resistance): 70kR; Load Capacitance: 6pF; Frequency: 32.768kHz; Case/Package: SMD/SMT; Packaging: Tape and Reel; Ratings: AEC-Q200; Max Operating Temperature: 85°C; Mount: Surface Mount; Min Operating Temperature: -40°C
Y4 = CMP-200220-000007-1: CRYSTAL 16.0000MHZ 8PF SMD; Frequency Stability: 30ppm; Frequency Tolerance: 20ppm; Frequency: 16MHz; ESR (Equivalent Series Resistance): 80R; Min Operating Temperature: -40°C; Mount: Surface Mount; Width: 0.098inch; Case/Package: SMD/SMT; Max Operating Temperature: 85°C; Number of Pins: 4; Length: 0.126inch; Load Capacitance: 8pF; Packaging: Tape and Reel; Package Quantity: 3000; Height: 0.035inch

## Sheet PMIC_Debug.SchDoc
size 420 x 297 mm; SheetNumber: 15; SheetTotal: 21
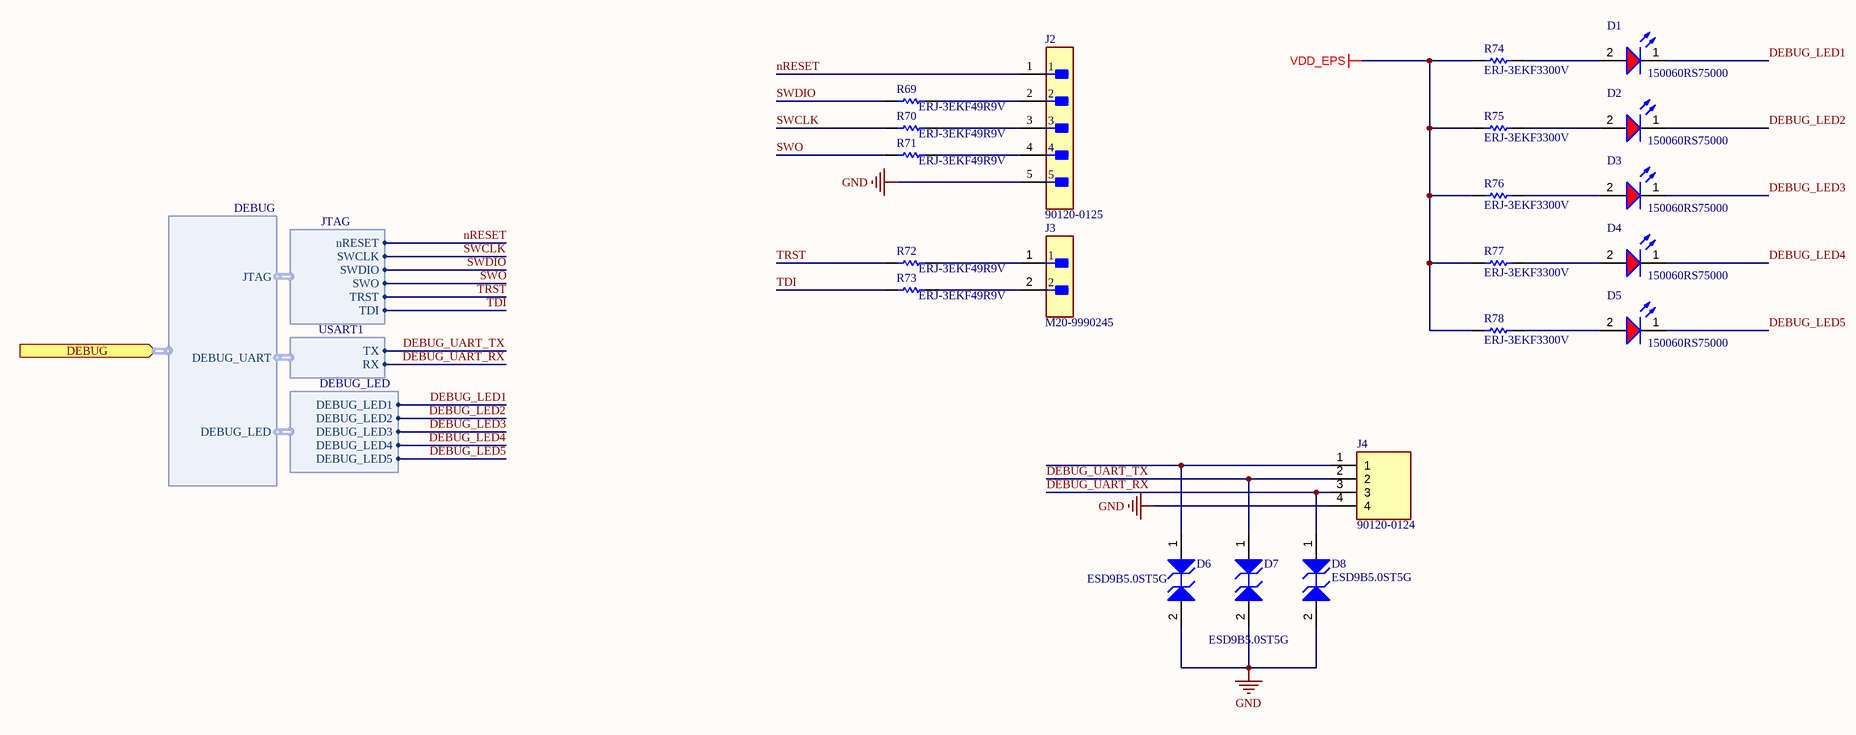
[diagram p5: PMIC_Debug.SchDoc]

### Parts
D1  150060RS75000  [WL-SMCW_0603_150060xx75000]
D2  150060RS75000  [WL-SMCW_0603_150060xx75000]
D3  150060RS75000  [WL-SMCW_0603_150060xx75000]
D4  150060RS75000  [WL-SMCW_0603_150060xx75000]
D5  150060RS75000  [WL-SMCW_0603_150060xx75000]
D6  ESD9B5.0ST5G  [ONSC-SOD-923-2-514AB-01_V]
D7  ESD9B5.0ST5G  [ONSC-SOD-923-2-514AB-01_V]
D8  ESD9B5.0ST5G  [ONSC-SOD-923-2-514AB-01_V]
J2  90120-0125  [FP-90120-0125-MFG]
J3  M20-9990245  [FP-M20-9990245-MFG]
J4  90120-0124  [HDRV4W65P0X254_1X4_1016X254X945P]
R69  ERJ-3EKF49R9V  [RESC1608X55X30ML15T15]
R70  ERJ-3EKF49R9V  [RESC1608X55X30ML15T15]
R71  ERJ-3EKF49R9V  [RESC1608X55X30ML15T15]
R72  ERJ-3EKF49R9V  [RESC1608X55X30ML15T15]
R73  ERJ-3EKF49R9V  [RESC1608X55X30ML15T15]
R74  ERJ-3EKF3300V  [RESC1608X55X30LL15T15]
R75  ERJ-3EKF3300V  [RESC1608X55X30LL15T15]
R76  ERJ-3EKF3300V  [RESC1608X55X30LL15T15]
R77  ERJ-3EKF3300V  [RESC1608X55X30LL15T15]
R78  ERJ-3EKF3300V  [RESC1608X55X30LL15T15]

### Ports
DEBUG (in, harness DEBUG)

### Harnesses
DEBUG: JTAG, DEBUG_UART, DEBUG_LED
JTAG: nRESET, SWCLK, SWDIO, SWO, TDI, TRST
USART1: TX, RX
DEBUG_LED: DEBUG_LED1, DEBUG_LED2, DEBUG_LED3, DEBUG_LED4, DEBUG_LED5

### Nets
GND: D6.2(A2) D7.2(A2) D8.2(A2) J2.5 J4.4
VDD_EPS: R74.1 R75.1 R76.1 R77.1 R78.1
DEBUG_LED1: D1.1(K) ; harness DEBUG_LED.DEBUG_LED1
DEBUG_LED2: D2.1(K) ; harness DEBUG_LED.DEBUG_LED2
DEBUG_LED3: D3.1(K) ; harness DEBUG_LED.DEBUG_LED3
DEBUG_LED4: D4.1(K) ; harness DEBUG_LED.DEBUG_LED4
DEBUG_LED5: D5.1(K) ; harness DEBUG_LED.DEBUG_LED5
DEBUG_UART_RX: D8.1(A1) J4.3 ; harness USART1.RX
DEBUG_UART_TX: D7.1(A1) J4.2 ; harness USART1.TX
nRESET: J2.1 ; harness JTAG.nRESET
SWCLK: R70.1 ; harness JTAG.SWCLK
SWDIO: R69.1 ; harness JTAG.SWDIO
SWO: R71.1 ; harness JTAG.SWO
TDI: R73.1 ; harness JTAG.TDI
TRST: R72.1 ; harness JTAG.TRST
NetD1_2: D1.2(A) R74.2
NetD2_2: D2.2(A) R75.2
NetD3_2: D3.2(A) R76.2
NetD4_2: D4.2(A) R77.2
NetD5_2: D5.2(A) R78.2
NetD6_1: D6.1(A1) J4.1
NetJ2_2: J2.2 R69.2
NetJ2_3: J2.3 R70.2
NetJ2_4: J2.4 R71.2
NetJ3_1: J3.1 R72.2
NetJ3_2: J3.2 R73.2

### Notes on the sheet
- THIS DOCUMENT AND THE DATA DISCLOSED HEREIN OR
- HEREWITH IS THE PROPERTY OF ALTIUM LIMITED AND MAY
- DWG NO:
- REVISION
- REV:
- DESCRIPTION
- DATE
- APPROVED
- BE FREELY DISTRIBUTED IN WHOLE. NO RIGHTS ARE
- RESERVED OR EXPRESS OR IMPLIED WARANTEE GIVEN.
- ENG:
- APPROVALS
- PROJECT
- DSN:
- CHK:
- REFERENCE DOCUMENTS
- PROJECT REVISION:
- TITLE
- DOCUMENT REVISION:
- DESIGN ITEM:
- BOM:
- FAB DWG:
- PCB DWG:
- ASSY DWG:
- SCALE:
- A3
- SIZE
- CAGE CODE
- FILE NAME
- DWG NO.
- SHEET
- OF
- REV

### Library data of the parts
D1-D5 = CMP-1426-00001-4: LED Low-Power Uni-Color Red 630nm 2V 2-Pin Chip 0603(1608Metric) T/R; Max Junction Temperature (Tj): 95°C; Dominant Wavelength: 625nm; Lens Style: Clear, Rectangular; Viewing Angle: 140°; Forward Current: 100mA; Max Reverse Voltage (DC): 5V; Luminous Intensity: 250mcd; Test Current: 20mA; Power Dissipation: 72mW; Max Operating Temperature: 85°C; Mount: Surface Mount; Height: 700µm; Packaging: Tape and Reel; REACH SVHC: Unknown; Case Code (Metric): 1608; Peak Wavelength: 630nm; Forward Voltage: 2V; Case/Package: 0603; Color: Red; RoHS: Compliant; Width: 800µm; Reverse Voltage: 5V; Min Operating Temperature: -40°C; Wavelength: 625nm; Case Code (Imperial): 0603; Length: 1.6mm
D6-D8 = CMP-1063-00119-1: Transient Voltage Suppressor, Micro-Packaged Diode for ESD Protection, 2-Pin SOD-923, Pb-Free, Tape and Reel; Manufacturer: On Semiconductor; Number of Lines: 1; Direction: Bidirectional; V(BR) Min (V): 5.8; VRWM Max (V): 5; Packing: Tape and Reel; PackageDescription: 2-Pin SOD, Body 0.8 x 0.6 mm; IR Max (uA): 1; ComponentLink3Description: Package Specification; PartNumber: ESD9B5.0ST5G; ComponentLink1URL: http://www.onsemi.com/; RoHS: Pb-Free; Mounting Technology: Surface Mount; DatasheetVersion: Rev. 2; ComponentLink2URL: http://www.onsemi.cn/pub_link/Collateral/ESD9B-D.PDF; ComponentLink3URL: http://www.onsemi.com/pub_link/Collateral/514AB.PDF; PackageReference: SOD-923-2-514AB-01; PackageVersion: Rev. C, 03/2011; ComponentLink1Description: Manufacturer URL; ComponentLink2Description: Datasheet
J2 = CMP-00257-00655425-1: 90120-0125 2.54mm Pitch C-Grid III Header, Single Row, Vertical, 5 Circuits, Tin (Sn) Plating; NexarPartId: 655425; Manufacturer Lifecycle Status: ACTIVE; Lead Length: 2.9mm; Number of Positions: 5; Current Rating: 3A; Mating Post Length: 6.75mm; Glow Wire Compliant: Non-compliant; Contact Resistance: 20mΩ; Voltage Rating: 350V; Gender: Male; Max Voltage Rating (DC): 350.35kV; Max Operating Temperature: 125°C; Number of Pins: 5; Plating: Tin; Contact Material: Brass; Mount: Through Hole; Contact Gender: Male; Packaging: Bulk; Schedule B: 8536694040; Lifecycle Status: Production; Lead Pitch: 2.54mm; Radiation Hardening: No; Orientation: Vertical; Min Operating Temperature: -55°C; Country of Origin: SK; Housing Color: Black; REACH SVHC: No SVHC; Contact Plating: Tin; Number of Rows: 1; Number of Circuits: 5; Termination: Solder; Number of Contacts: 5; Pitch: 2.54mm; Housing Material: Polyester; RoHS: Compliant; Lead Free: Lead Free; Voltage Rating (AC): 350V
J3 = CMP-15831-000105-1: CONN HEADER VERT 2POS 2.54MM; Working Voltage: 750V; Gender: Male; Number of Poles: 2; Current Rating: 3A; Mated Stacking Heights: 16.54mm; Contact Resistance: 25mR; Connector Type: Male Pin; Insulation Resistance: 10GR; Mating Cycles: 300; Voltage: 50V; Flammability Rating: UL94 V-0; Pitch: 2.54mm; Series: M20; Number of Contacts: 2; Height: 0.12inch; Min Operating Temperature: -40°C; Contact Finish - Mating: GOLD; Number of Positions: 2; Number of Rows: 1; Packaging: Bulk; Package Quantity: 1000; Voltage Rating (AC): 750V; Current: 3A; Mount: Through Hole; Case/Package: SIL; Orientation: Straight; Contact Shape: Square; Weight: 0.25lb; Radiation Hardening: No; Fastening Type: Pull; Length: 5.08mm; Depth: 2.54mm; Contact Mating Length: 0.24inch; Housing Material: Nylon; Reach SVHC Compliant: Yes; Insulation Material: Nylon; Color: Black; Width: 0.25inch; Insulation Color: Black; Contact Material: Brass; Contact Type: Male Pin; Termination: Solder; Max Operating Temperature: 105°C; Contact Plating: Gold; Housing Color: Black; Max Current Rating: 3A; Lead Pitch: 2.54mm
J4 = 90120-0124: Connector; Manufacturer_Name: Molex; Datasheet Link: https://componentsearchengine.com/Datasheets/2/90120-0124.pdf; Height: 9.45mm; Manufacturer_Part_Number: 90120-0124; Mouser Part Number: 538-90120-0124; Mouser Price/Stock: https://www.mouser.co.uk/ProductDetail/Molex/90120-0124?qs=PvP5v7EimsmprSEogp1JLQ%3D%3D
R69-R73 = CMP-2000-00538-1: Manufacturer: Panasonic; Part Number: ERJ-3EKF49R9V
R74-R78 = CMP-2000-00435-2: Chip Resistor, 330 Ohm, +/- 1%, 0.1 W, -55 to 155 degC, 0603 (1608 Metric), RoHS, Tape and Reel; Gender: Male; Mating Cycles: 10000; Current Rating: 500 mA; Voltage Rating: 10 V; REACH SVHC: No SVHC; PackageDescription: 2-Pin Surface Mount Device, Body 1.6 x 0.85 mm; Contact Finish: Gold; Pins: 8; ComponentLink1Description: Manufacturer URL; Packaging: Tape and Reel; Max Operating Temperature: 85 degC; Contact Material: Copper; Height: 1.45 mm; Width: 1.45 mm; DatasheetVersion: Apr-15; Package Quantity: 1500; Contact Plating: Gold; PackageReference: 0603; Mount: Surface Mount; Lead Pitch: 1.1 mm; Min Operating Temperature: -25 degC; ComponentLink1URL: http://www.panasonic.com/; ComponentLink2URL: http://industrial.panasonic.com/cdbs/www-data/pdf/RDA0000/AOA0000C86.pdf; Length: 13.7 mm; ComponentLink2Description: Datasheet; RoHSCompliant: true

## Sheet PC104-52-52.SchDoc
size 420 x 297 mm; SheetNumber: 17; SheetTotal: 21; ENG_APP_DATE: --/--/--; DSN_APP_DATE: --/--/--; CHK_APP_DATE: --/--/--
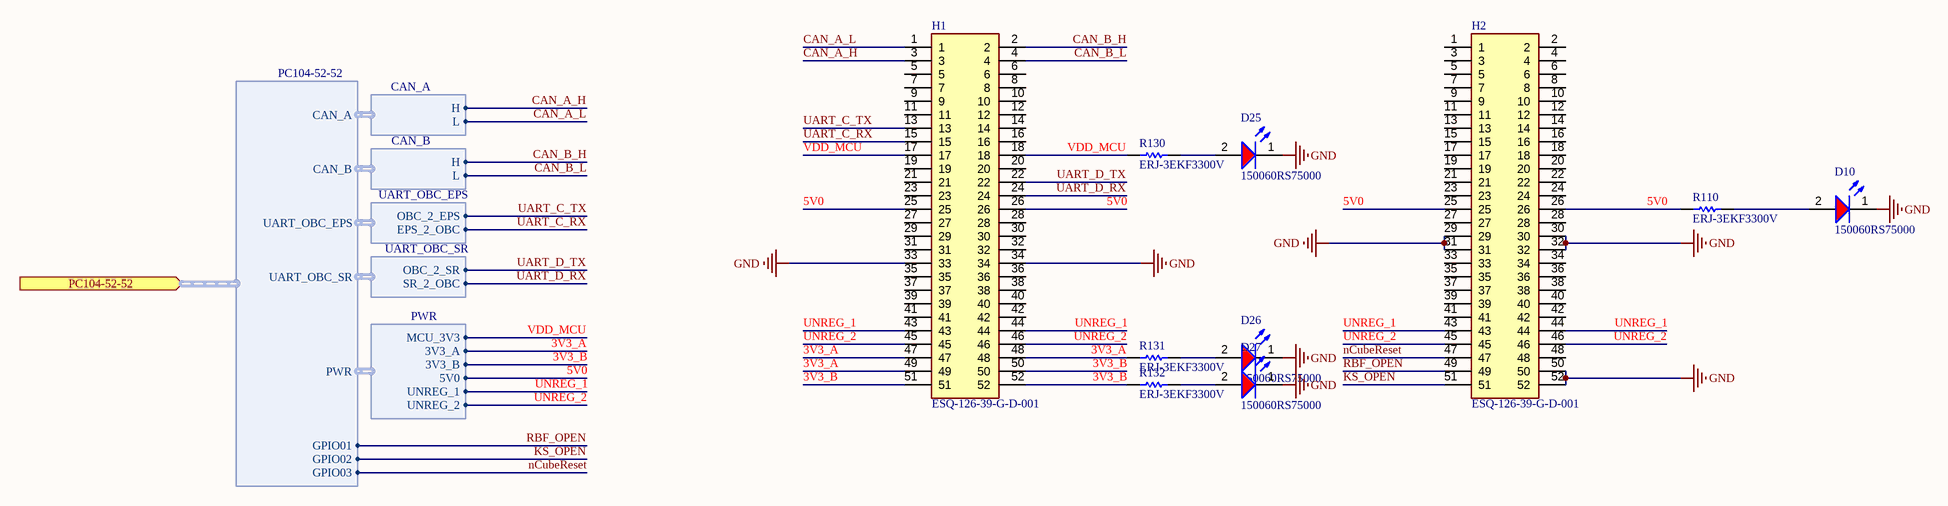
[diagram p6: PC104-52-52.SchDoc]

### Parts
D10  150060RS75000  [WL-SMCW_0603_150060xx75000]
D25  150060RS75000  [WL-SMCW_0603_150060xx75000]
D26  150060RS75000  [WL-SMCW_0603_150060xx75000]
D27  150060RS75000  [WL-SMCW_0603_150060xx75000]
H1  ESQ-126-39-G-D-001  [RHDR52W64P254_2X26_6654X495X1135P]
H2  ESQ-126-39-G-D-001  [RHDR52W64P254_2X26_6654X495X1135P]
R110  ERJ-3EKF3300V  [RESC1608X55X30LL15T15]
R130  ERJ-3EKF3300V  [RESC1608X55X30LL15T15]
R131  ERJ-3EKF3300V  [RESC1608X55X30LL15T15]
R132  ERJ-3EKF3300V  [RESC1608X55X30LL15T15]

### Ports
PC104-52-52 (in, harness PC104-52-52)

### Harnesses
PC104-52-52: CAN_A, CAN_B, UART_OBC_SR, UART_OBC_EPS, PWR, GPIO01, GPIO02, GPIO03
CAN_A: L, H
CAN_B: L, H
PWR: MCU_3V3, 3V3_A, 3V3_B, 5V0, UNREG_1, UNREG_2
UART_OBC_SR: OBC_2_SR, SR_2_OBC
UART_OBC_EPS: EPS_2_OBC, OBC_2_EPS

### Nets
GND: D10.1(K) D25.1(K) D26.1(K) D27.1(K) H1.33 H1.34 H2.29 H2.30 H2.31 H2.32 H2.50 H2.52
3V3_A: H1.47 H1.48 H1.49 R131.1 ; harness PWR.3V3_A  [project net 3V3_1]
3V3_B: H1.50 H1.51 H1.52 R132.1 ; harness PWR.3V3_B  [project net 3V3_2]
5V0: H1.25 H1.26 H2.25 H2.26 R110.1 ; harness PWR.5V0
CAN_A_H: H1.3 ; harness CAN_A.H
CAN_A_L: H1.1 ; harness CAN_A.L
CAN_B_H: H1.2 ; harness CAN_B.H
CAN_B_L: H1.4 ; harness CAN_B.L
KS_OPEN: H2.51 ; port PC104-52-52.GPIO02
nCubeReset: H2.47 ; port PC104-52-52.GPIO03
RBF_OPEN: H2.49 ; port PC104-52-52.GPIO01
UART_C_RX: H1.15 ; harness UART_OBC_EPS.EPS_2_OBC  [project net EPS_2_OBC]
UART_C_TX: H1.13 ; harness UART_OBC_EPS.OBC_2_EPS  [project net OBC_2_EPS]
UART_D_RX: H1.24 ; harness UART_OBC_SR.SR_2_OBC  [project net SR_2_OBC]
UART_D_TX: H1.22 ; harness UART_OBC_SR.OBC_2_SR  [project net OBC_2_SR]
UNREG_1: H1.43 H1.44 H2.43 H2.44 ; harness PWR.UNREG_1
UNREG_2: H1.45 H1.46 H2.45 H2.46 ; harness PWR.UNREG_2
VDD_MCU: H1.17 H1.18 R130.1 ; harness PWR.MCU_3V3
NetD10_2: D10.2(A) R110.2
NetD25_2: D25.2(A) R130.2
NetD26_2: D26.2(A) R131.2
NetD27_2: D27.2(A) R132.2

Not connected (* = marked no-connect by the designer): H1 5 6 7 8 9 10 11 12 14 16 19 20 21 23 27 28 29 30 31 32 35 36 37 38 39 40 41 42; H2 1 2 3 4 5 6 7 8 9 10 11 12 13 14 15 16 17 18 19 20 21 22 23 24 27 28 33 34 35 36 37 38 39 40 41 42 48

### Notes on the sheet
- THIS DOCUMENT AND THE DATA DISCLOSED HEREIN OR
- HEREWITH IS THE PROPERTY OF ALTIUM LIMITED AND MAY
- DWG NO:
- REVISION
- REV:
- DESCRIPTION
- DATE
- APPROVED
- BE FREELY DISTRIBUTED IN WHOLE. NO RIGHTS ARE
- RESERVED OR EXPRESS OR IMPLIED WARANTEE GIVEN.
- ENG:
- APPROVALS
- PROJECT
- DSN:
- CHK:
- REFERENCE DOCUMENTS
- PROJECT REVISION:
- TITLE
- DOCUMENT REVISION:
- DESIGN ITEM:
- BOM:
- FAB DWG:
- PCB DWG:
- ASSY DWG:
- SCALE:
- A3
- SIZE
- CAGE CODE
- FILE NAME
- DWG NO.
- SHEET
- OF
- REV

### Library data of the parts
D10 D25-D27 = CMP-1426-00001-4: as D1 on sheet PMIC_Debug; Max Operating Temperature: 85°C; Mount: Surface Mount; Height: 700µm; Packaging: Tape and Reel; REACH SVHC: Unknown; Case Code (Metric): 1608; Peak Wavelength: 630nm; Forward Voltage: 2V; Case/Package: 0603; Color: Red; RoHS: Compliant; Width: 800µm; Reverse Voltage: 5V; Min Operating Temperature: -40°C; Wavelength: 625nm; Case Code (Imperial): 0603; Length: 1.6mm
H1 H2 = CMP-002-00086-1: PC / 104 Connectors Elevated Socket Strip; Manufacturer_Name: SAMTEC; Design Item ID: ESQ-126-39-G-D-001; Mouser Price/Stock: https://www.mouser.co.uk/ProductDetail/Samtec/ESQ-126-39-G-D-001?qs=PB6%2FjmICvI2K%2FCIgL4SVbg%3D%3D; Mouser Part Number: 200-ESQ12639GD001; Source: SamacSys.SchLib; Arrow Price/Stock: https://www.arrow.com/en/products/esq-126-39-g-d-001/samtec?region=nac; Arrow Part Number: ESQ-126-39-G-D-001; Manufacturer_Part_Number: ESQ-126-39-G-D-001; Datasheet Link: http://suddendocs.samtec.com/catalog_english/esq_th.pdf; Height: 11.35mm
R110 R130-R132 = CMP-2000-00435-2: as R74 on sheet PMIC_Debug; REACH SVHC: No SVHC; PackageDescription: 2-Pin Surface Mount Device, Body 1.6 x 0.85 mm; Contact Finish: Gold; Pins: 8; ComponentLink1Description: Manufacturer URL; Packaging: Tape and Reel; Max Operating Temperature: 85 degC; Contact Material: Copper; Height: 1.45 mm; Width: 1.45 mm; DatasheetVersion: Apr-15; Package Quantity: 1500; Contact Plating: Gold; PackageReference: 0603; Mount: Surface Mount; Lead Pitch: 1.1 mm; Min Operating Temperature: -25 degC; ComponentLink1URL: http://www.panasonic.com/; ComponentLink2URL: http://industrial.panasonic.com/cdbs/www-data/pdf/RDA0000/AOA0000C86.pdf; Length: 13.7 mm; ComponentLink2Description: Datasheet; RoHSCompliant: true

## Sheet Mram.SchDoc
size 420 x 297 mm; SheetNumber: 18; SheetTotal: 21
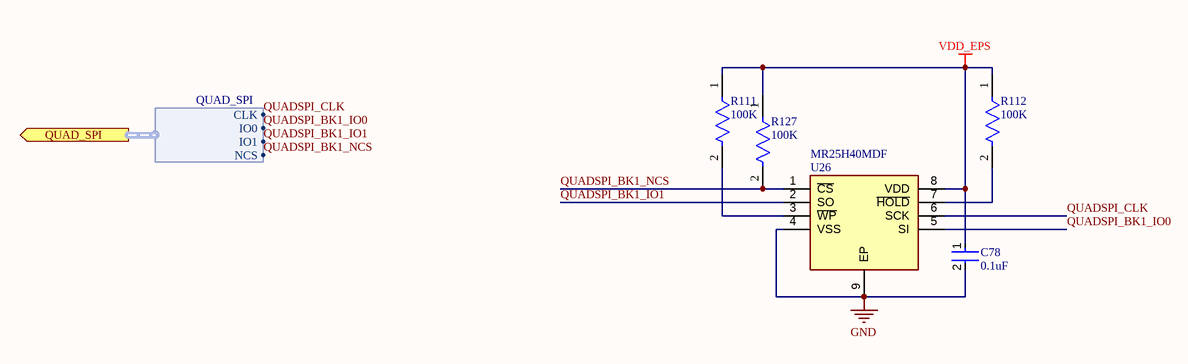
[diagram p7: Mram.SchDoc]

### Parts
C78  0.1uF  [FP-C0603C-CF-MFG]
R111  100K  [FP-ERA3A-MFG]
R112  100K  [FP-ERA3A-MFG]
R127  100K  [FP-ERA3A-MFG]
U26  MR25H40MDF  [SON127P600X500X90-9N-D]

### Ports
QUAD_SPI (out, harness QUAD_SPI)

### Harnesses
QUAD_SPI: CLK, IO0, IO1, NCS

### Nets
GND: C78.2 U26.4(VSS) U26.9(EP)
VDD_EPS: C78.1 R111.1 R112.1 R127.1 U26.8(VDD)
QUADSPI_BK1_IO0: U26.5(SI) ; port QUAD_SPI.IO0
QUADSPI_BK1_IO1: U26.2(SO) ; port QUAD_SPI.IO1
QUADSPI_BK1_NCS: R127.2 U26.1(~{CS}) ; port QUAD_SPI.NCS
QUADSPI_CLK: U26.6(SCK) ; port QUAD_SPI.CLK
NetR111_2: R111.2 U26.3(~{WP})
NetR112_2: R112.2 U26.7(~{HOLD})

### Notes on the sheet
- THIS DOCUMENT AND THE DATA DISCLOSED HEREIN OR
- HEREWITH IS THE PROPERTY OF ALTIUM LIMITED AND MAY
- DWG NO:
- REVISION
- REV:
- DESCRIPTION
- DATE
- APPROVED
- BE FREELY DISTRIBUTED IN WHOLE. NO RIGHTS ARE
- RESERVED OR EXPRESS OR IMPLIED WARANTEE GIVEN.
- ENG:
- APPROVALS
- PROJECT
- DSN:
- CHK:
- REFERENCE DOCUMENTS
- PROJECT REVISION:
- TITLE
- DOCUMENT REVISION:
- DESIGN ITEM:
- BOM:
- FAB DWG:
- PCB DWG:
- ASSY DWG:
- SCALE:
- A3
- SIZE
- CAGE CODE
- FILE NAME
- DWG NO.
- SHEET
- OF
- REV

### Library data of the parts
C78 = CMP-2006-03061-2: as C67 on sheet PMIC_Watchdog; Temperature: -55°C to +125°C; RoHS: TRUE; Temperature Range High: +125°C; Lead Free: Yes; Octopart: https://octopart.com/c0603c104k5ractu-kemet-139244; Digikey Description: CAP CER 0.1UF 50V X7R 0603; Category: Cap; Package: C0603C-CF; ComponentLink2Description: Datasheet; Temperature Range Low: -55°C; Device Class L1: Passive Components; Voltage Rating: 50 V; Automotive: Yes; Device Class L3: Ceramic Capacitors; ComponentLink2URL: https://api.kemet.com/component-edge/download/datasheet/C0603C100J5GACAUTO.pdf; Capacitance: 0.10 μF; Device Class L2: Capacitors; Temperature Characteristic: X7R; Height: 0.87mm
R111 R112 R127 = CMP-2000-00875-2: as R68 on sheet PMIC_Watchdog; Contact Plating: Tin; Max Operating Temperature: 155°C; Case Code (Imperial): 0603; Packaging: Cut Tape; Width: 800µm; Lead Free: Lead Free; REACH SVHC: No SVHC; Termination: SMD/SMT; Radiation Hardening: No; Length: 1.6mm; Military Standard: Not; Features: Automotive AEC-Q200; Case/Package: 0603; Number of Terminations: 2; Composition: Thin Film; Schedule B: 8533210045, 8533210045; Voltage Rating: 75V; Mount: Surface Mount; Case Code (Metric): 1608; Lifecycle Status: Production; Height: 450µm; RoHS: Compliant; Number of Pins: 2; Max Power Dissipation: 100mW; Min Operating Temperature: -55°C; Depth: 800µm; Working Voltage: 75V
U26 = MR25H40MDF: Integrated Circuit; Manufacturer_Name: Everspin Technologies; Datasheet Link: https://datasheet.datasheetarchive.com/originals/distributors/Datasheets-DGA23/1514724.pdf; Height: 0.9mm; Manufacturer_Part_Number: MR25H40MDF; Mouser Part Number: 936-MR25H40MDF; Mouser Price/Stock: https://www.mouser.co.uk/ProductDetail/Everspin-Technologies/MR25H40MDF?qs=laR3Dyet2Vc5UBOlfE70WA%3D%3D; Arrow Part Number: MR25H40MDF; Arrow Price/Stock: https://www.arrow.com/en/products/mr25h40mdf/everspin-technologies?utm_currency=USD&region=europe